# EAGLE board A10-OLinuXino_Rev_A (EAGLE 5.12), part 1 of 5
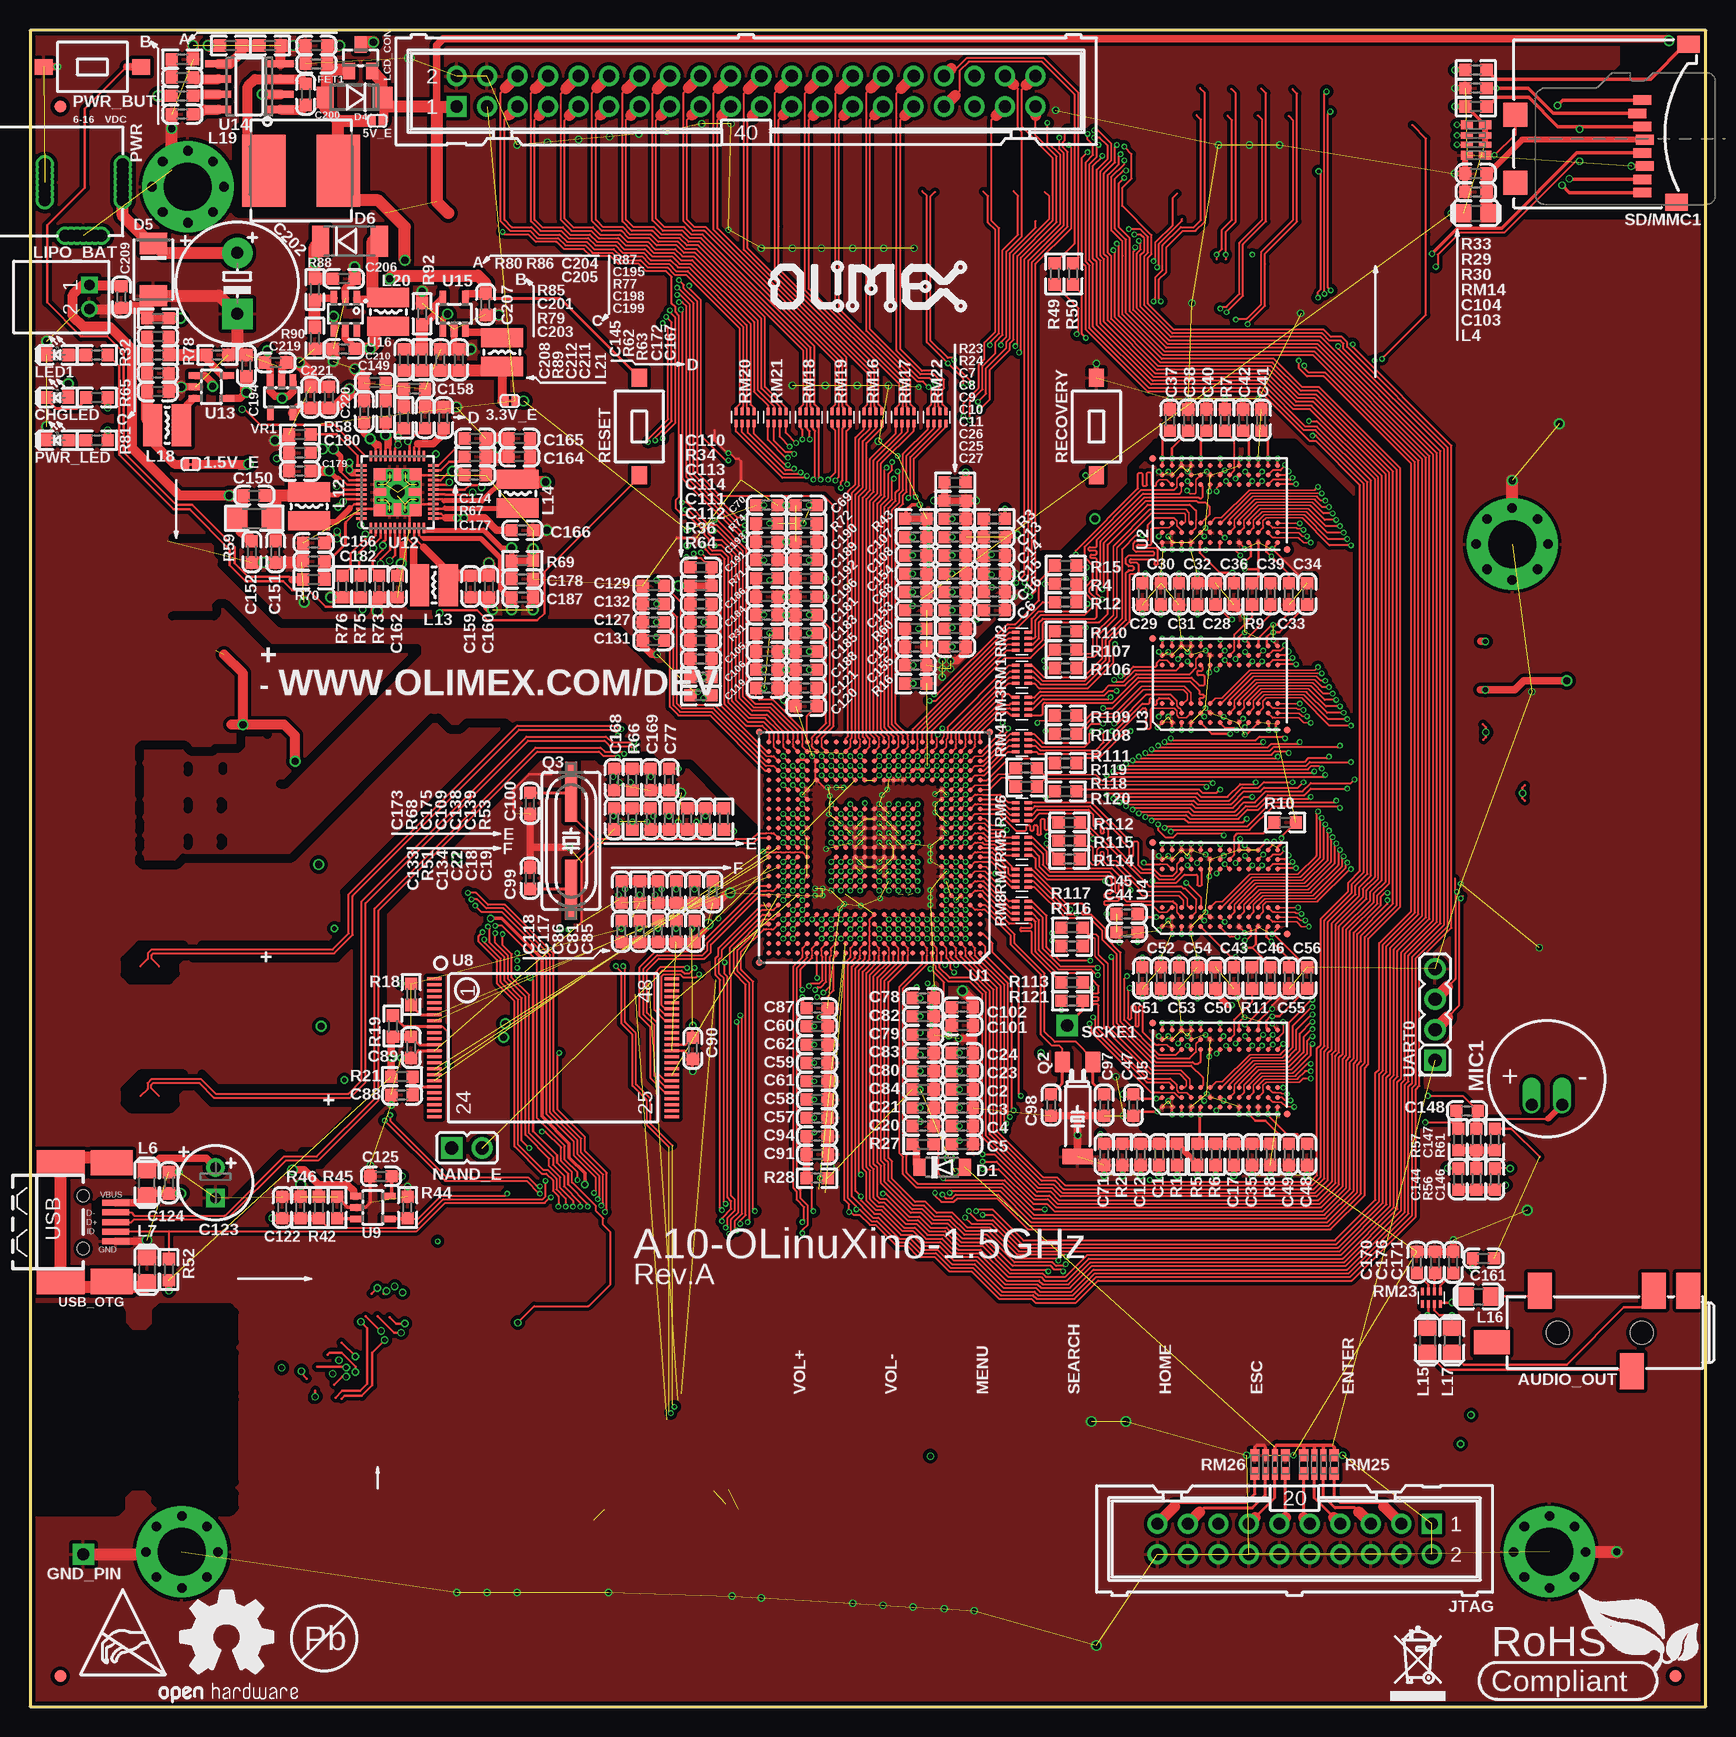
[diagram p5: board, top side]
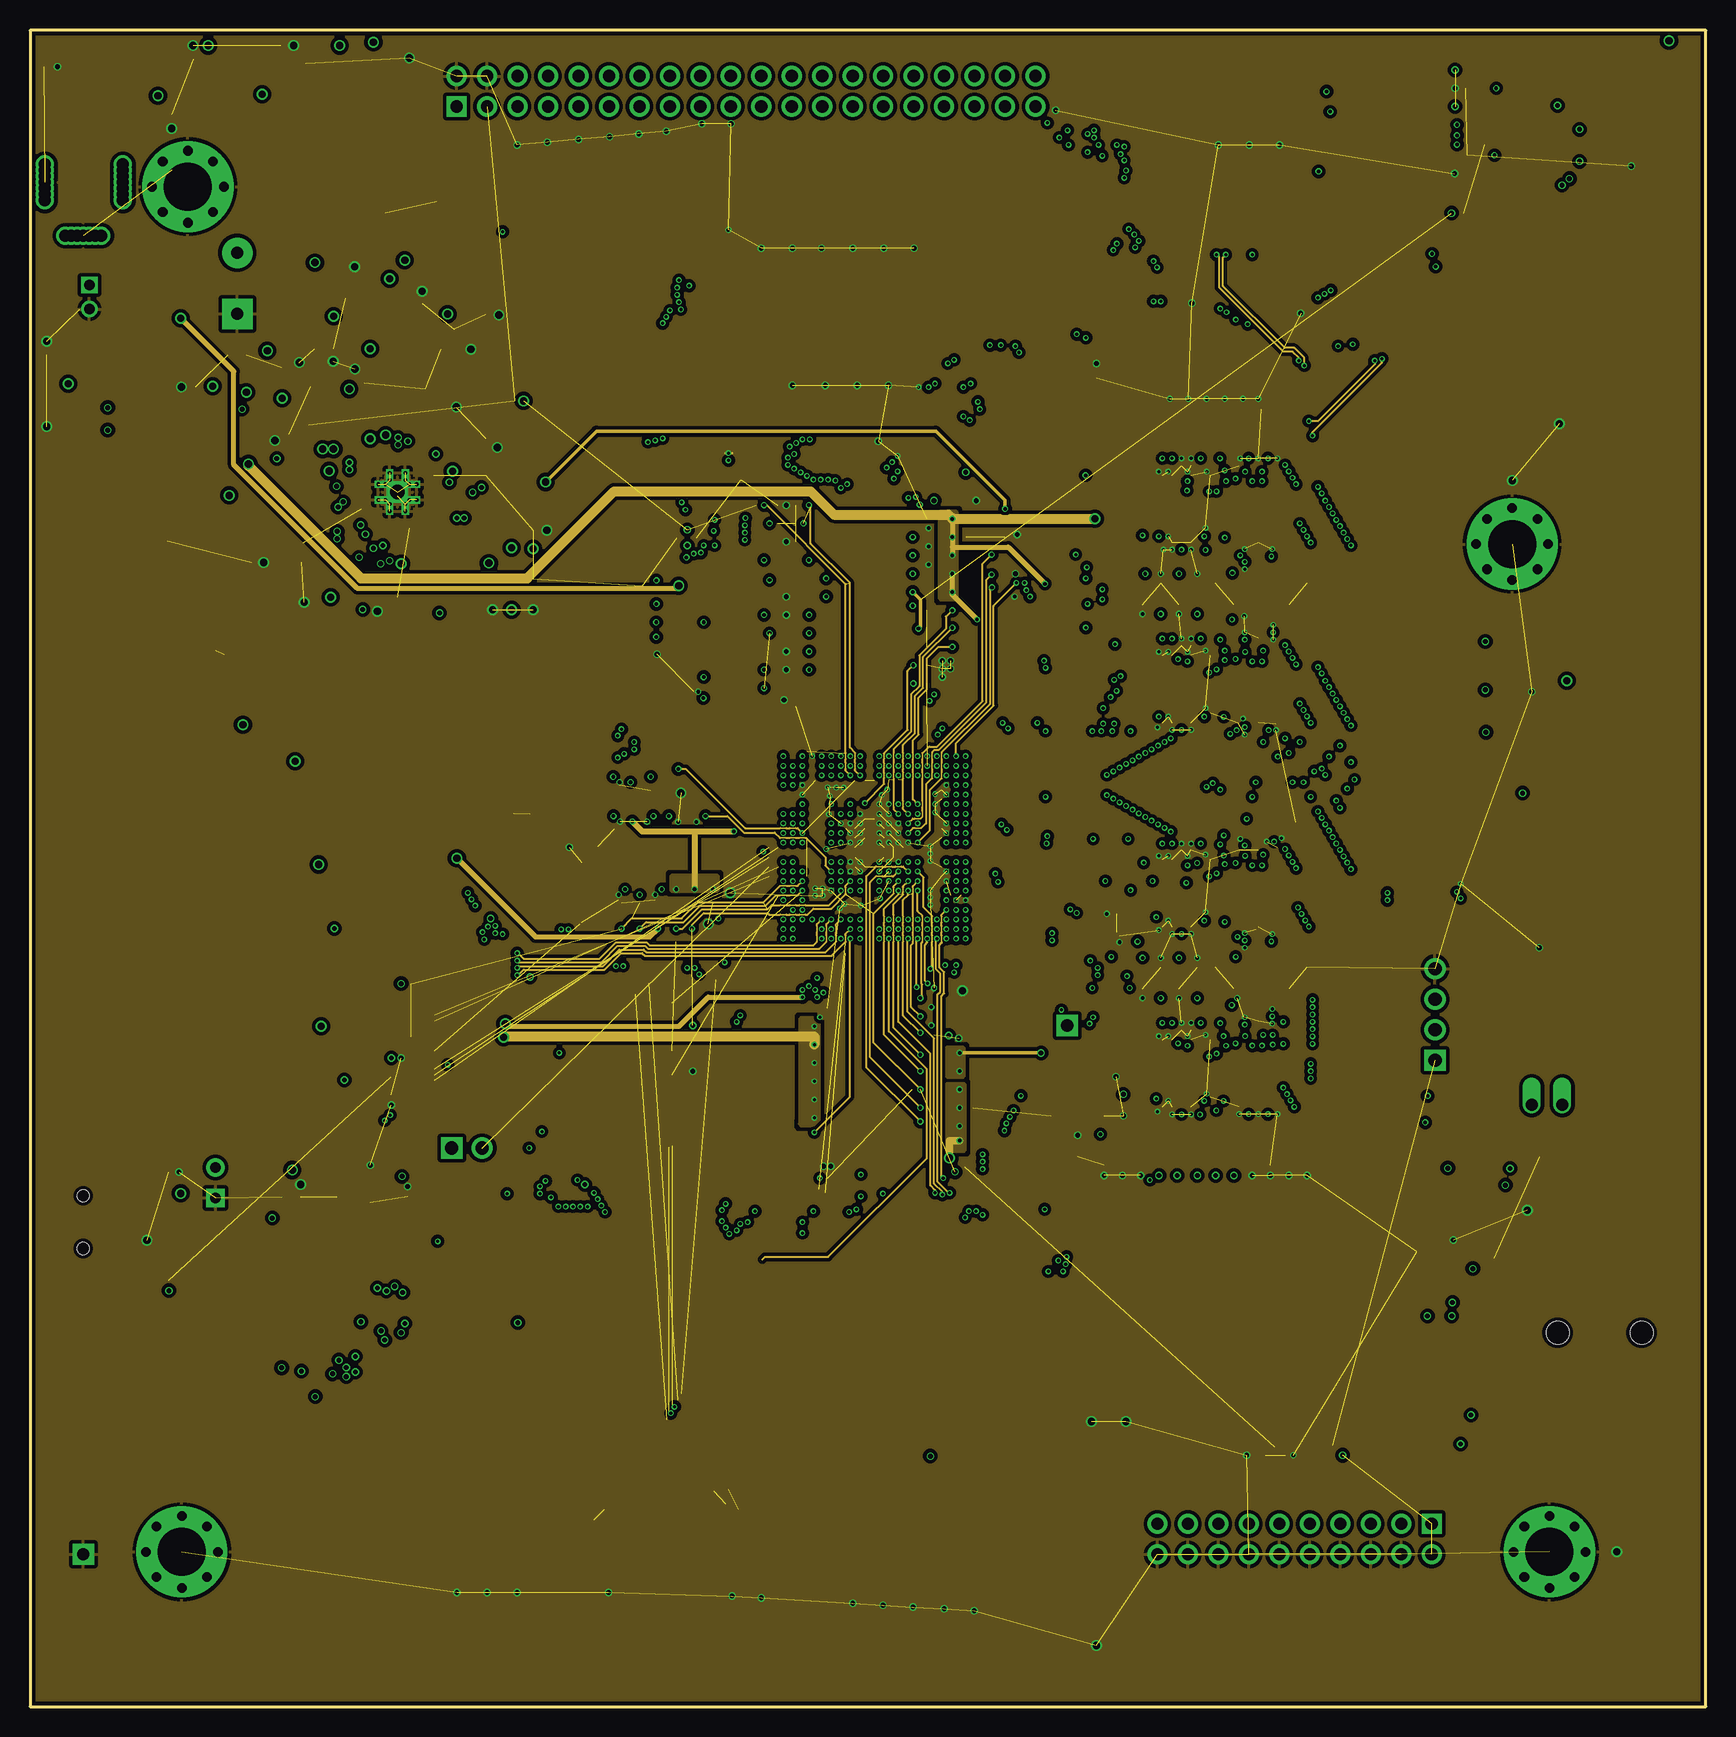
[diagram p6: board, inner layer Route2]
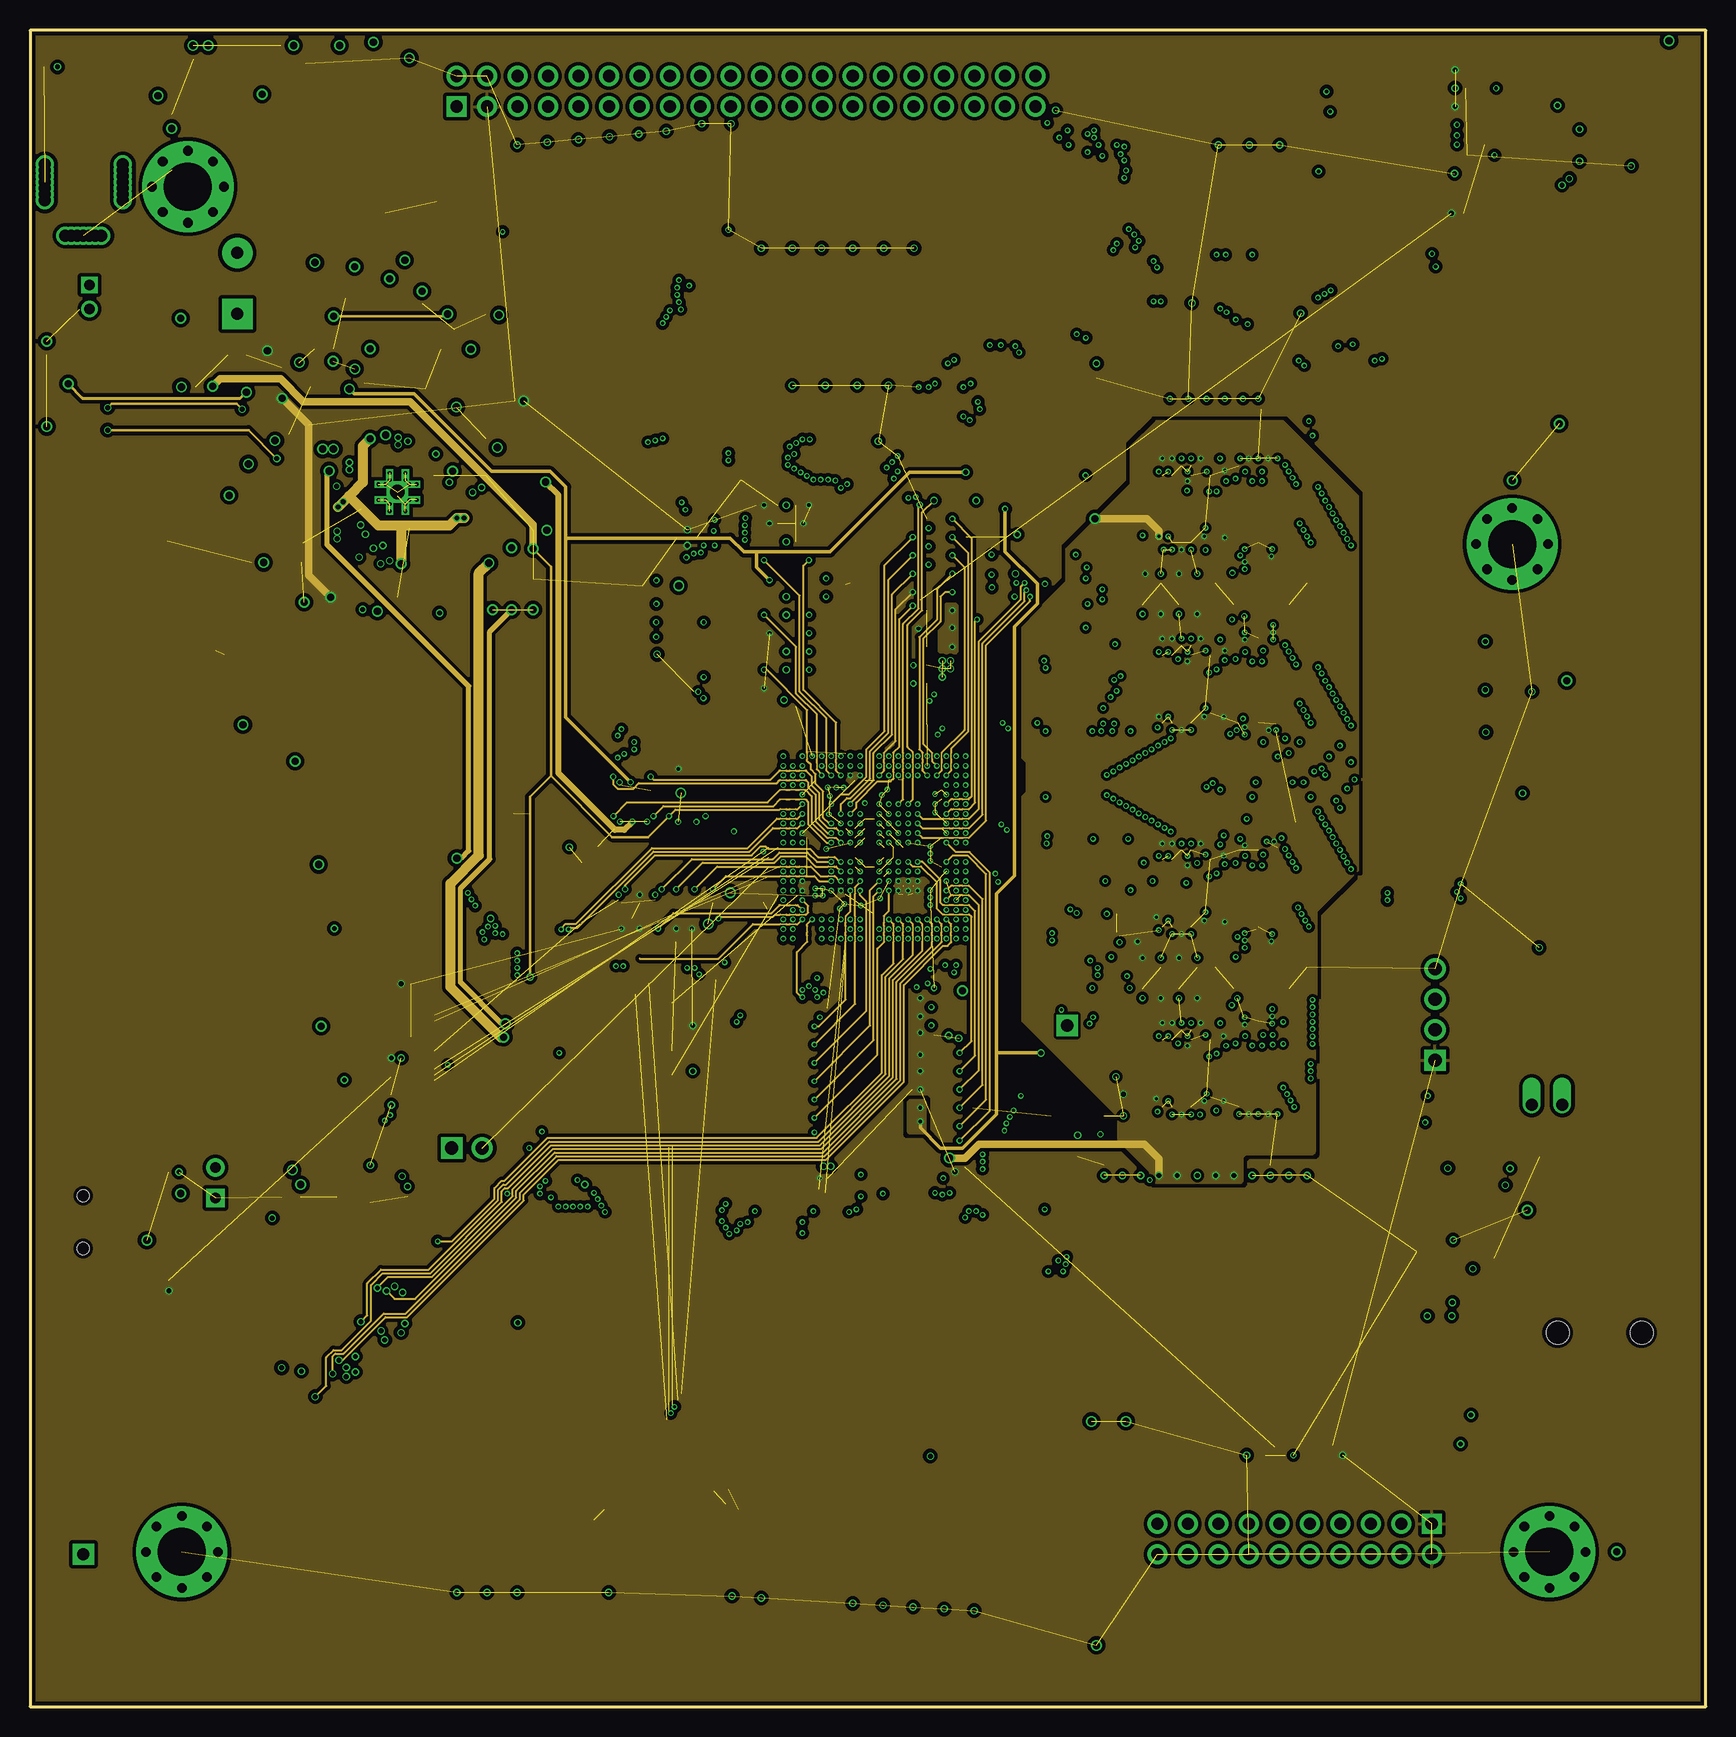
[diagram p7: board, inner layer Route15]
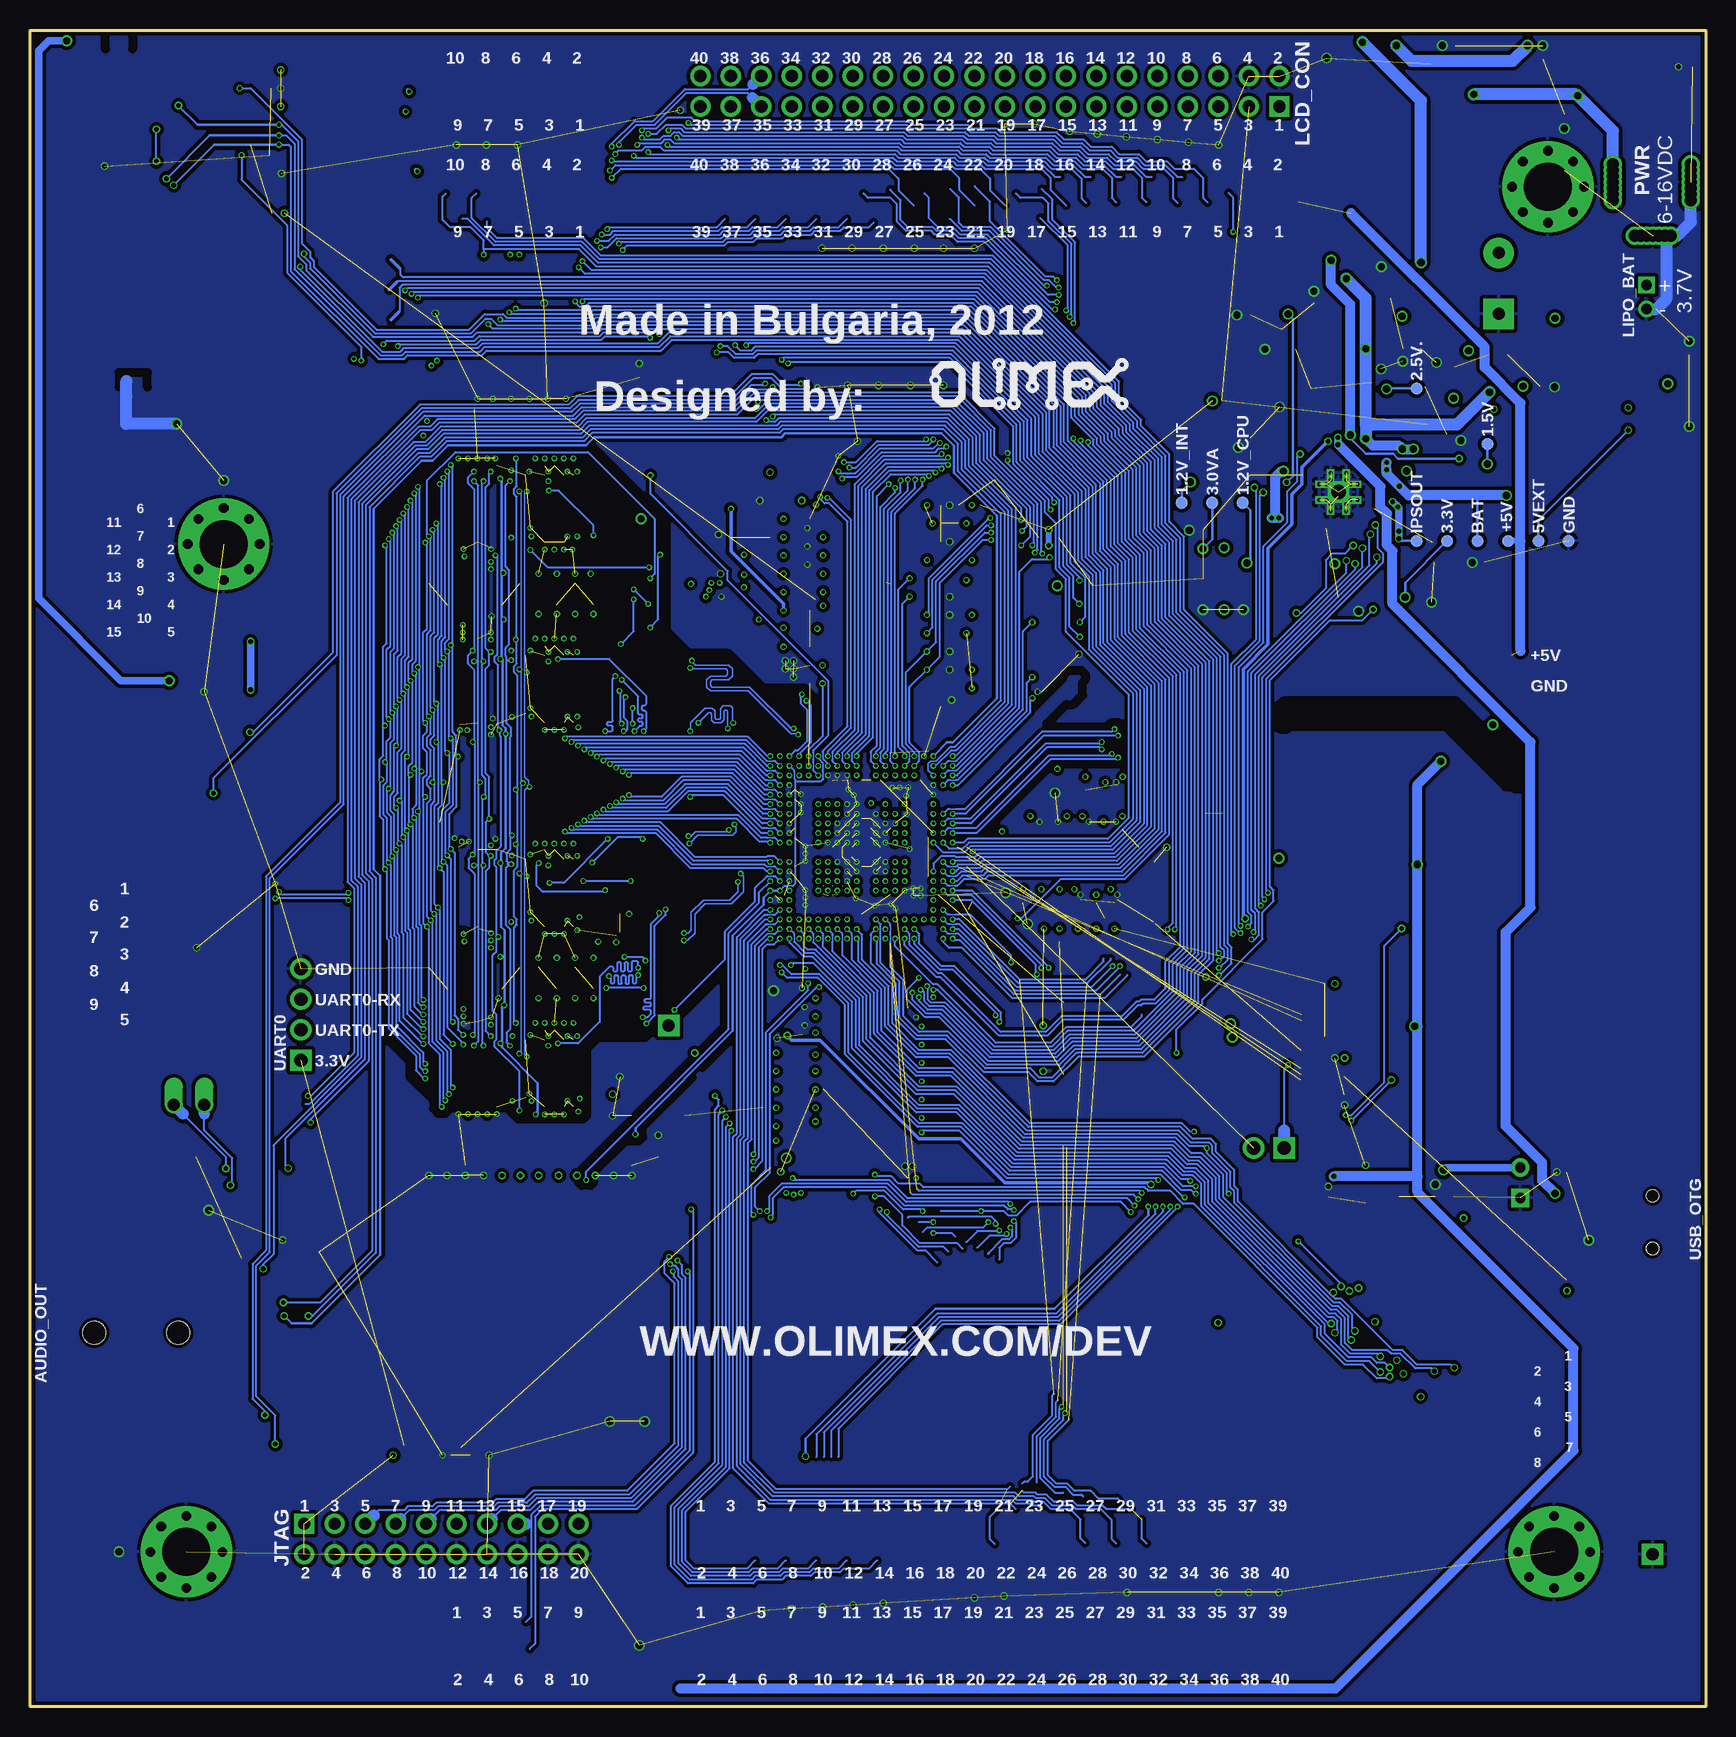
[diagram p8: board, bottom side, seen from below]

Size 139.7 x 139.7 mm. Coordinates in mm from the lower left corner, seen from the top.
Copper layers (1*2*15*16): Top 0.018mm / dielectric 0.12mm / Route2 0.035mm / dielectric 1.2mm / Route15 0.035mm / dielectric 0.12mm / Bottom 0.018mm
Design rules "default": minimum track width 4.5mil, minimum drill 10mil, track to track 5mil, track to pad 5mil, pad to pad 5mil, via to via 5mil, smd to smd 1mil, copper to edge 10mil, drill to drill 8mil, minimum pad ring 6mil, minimum via ring 4mil, stop-mask expansion 4mil, vias tented up to drill 25mil, thermal gap 12mil
Net classes: 1 PWR: width 0.127 mm, drill 0.254 mm, clearance 0.076 mm
tKeepout: 1 lines
tRestrict: 391 lines
bRestrict: 505 lines

## Footprints (pad centres in the part's own frame; a part is rotated, then mirrored left to right if it is on the bottom)
TESTPAD_40-ROUND = smd 1.016 x 1.016: 1 0,0
SJ_1_SMALLER_CLOSE = smd 0.508 x 0.762: 1 -0.381,0; 2 0.381,0
SJ_1_SMALLER = smd 0.508 x 0.762: 1 -0.381,0; 2 0.381,0
PJ-W47S-05D2-LF_5PIN_V2 = smd 2 x 3: 1 2.1,-0.5; 2 14.5,-0.5; 3 6.8,6.2; 5 5,-0.5 | smd 3 x 2: 4 18.5,3.8 | hole 1.9: 6,3; 13,3
C0603_DWS = smd 1.016 x 1.016: 1 -0.889,0; 2 0.889,0
E2,5-6,3 = drill 0.864 pad 1.524 round: + -1.27,0 | drill 0.864 pad 1.524 square: - 1.27,0
E5-10,5 = drill 1.016 pad 2.54 round: + -2.54,0 | drill 1.016 pad 2.54 square: - 2.54,0
LED-0603 = smd 1.016 x 1.016: A 0.889,0; C -0.889,0
SOD-123 = smd 1 x 1.4: A 1.9,0; C -1.9,0
MLL-41 = smd 1.45 x 1.8: A 2.445,0; K -2.445,0
DO214AA = smd 1.778 x 2.286: A 2.177,0; C -2.177,0
MELF-MLL41 = smd 1.45 x 2.6: 1 -2.445,0; 2 2.445,0
SOT23 = smd 1 x 1.4: 1 -0.95,-1.1; 2 0.95,-1.1; 3 0,1.1
TEST_PAD40/70/SQUARE = drill 1.016 pad 1.778 square: P$1 0,0
ML20-MALE = drill 1.016 pad 1.676 square: 1 -11.43,-1.27 | drill 1.016 pad 1.676 round: 2 -11.43,1.27; 3 -8.89,-1.27; 4 -8.89,1.27; 5 -6.35,-1.27; 6 -6.35,1.27; 7 -3.81,-1.27; 8 -3.81,1.27; 9 -1.27,-1.27; 10 -1.27,1.27; 11 1.27,-1.27; 12 1.27,1.27; 13 3.81,-1.27; 14 3.81,1.27; 15 6.35,-1.27; 16 6.35,1.27; 17 8.89,-1.27; 18 8.89,1.27; 19 11.43,-1.27; 20 11.43,1.27
L0805_5MIL_DWS = smd 1.27 x 1.524: 1 -1.016,0; 2 1.016,0
CD32 = smd 3.5 x 1.6: 1 0,1.2; 2 0,-1.2
8X8MM_3131 = smd 3.6 x 6: 1 -3.1,0; 2 3.1,0
ML40 = drill 1.016 pad 1.676 square: 1 -24.13,-1.27 | drill 1.016 pad 1.676 round: 2 -24.13,1.27; 3 -21.59,-1.27; 4 -21.59,1.27; 5 -19.05,-1.27; 6 -19.05,1.27; 7 -16.51,-1.27; 8 -16.51,1.27; 9 -13.97,-1.27; 10 -13.97,1.27; 11 -11.43,-1.27; 12 -11.43,1.27; 13 -8.89,-1.27; 14 -8.89,1.27; 15 -6.35,-1.27; 16 -6.35,1.27; 17 -3.81,-1.27; 18 -3.81,1.27; 19 -1.27,-1.27; 20 -1.27,1.27; 21 1.27,-1.27; 22 1.27,1.27; 23 3.81,-1.27; 24 3.81,1.27; 25 6.35,-1.27; 26 6.35,1.27; 27 8.89,-1.27; 28 8.89,1.27; 29 11.43,-1.27; 30 11.43,1.27; 31 13.97,-1.27; 32 13.97,1.27; 33 16.51,-1.27; 34 16.51,1.27; 35 19.05,-1.27; 36 19.05,1.27; 37 21.59,-1.27; 38 21.59,1.27; 39 24.13,-1.27; 40 24.13,1.27
DW02R = drill 0.9 square: 1 -1,0 | drill 0.9 round: 2 1,0
MIC = drill 1 offset: P+ -1.27,-2.159; P- 1.27,-2.159
JP1 = drill 1.1 pad 1.778 square: 1 0,-1.27 | drill 1.1 pad 1.778 round: 2 0,1.27
PWR_JACK_UNI_MILLING = drill 1 round: + 0,4.75; +1 0,5.25; +2 0,5.75; +3 0,6.25; +4 0,4.25; +5 0,3.75; +6 0,3.25; - -6.5,4.75; -1 -6.5,5.25; -2 -6.5,5.75; -3 -6.5,4.25; -4 -6.5,3.75; -5 -6.5,6.25; -6 -6.5,3.25; -- -3.3,0.3; --1 -3.8,0.3; --2 -4.3,0.3; --3 -4.8,0.3; --4 -2.8,0.3; --5 -2.3,0.3; --6 -1.8,0.3
SW-TAKT_6X3.5_SMD = smd 1.27 x 1.524: P$1 0,4.064; P$2 0,-4.064
TC26H_3_REPAIR_SMD = smd 1.27 x 1.778: 1 -1.27,0; 2 1.27,0 | smd 2.54 x 1.27: GND 0,7.874
HC49/SMD2_THIN = smd 5 x 1: 1 -4.064,0; 2 4.064,0
R0603_5MIL_DWS = smd 1.016 x 1.016: 1 -0.889,0; 2 0.889,0
0603_0R = smd 1.016 x 1.016: 1 -0.889,0; 2 0.889,0
R1206_5MIL_WS = smd 1.651 x 1.778: 1 -1.46,0; 2 1.46,0
R_MATRIX_4_0402_25X625 = smd 0.625 x 0.25: 1.1 -0.512,0.75; 1.2 0.512,0.75; 2.1 -0.512,0.25; 2.2 0.512,0.25; 3.1 -0.512,-0.25; 3.2 0.512,-0.25; 4.1 -0.512,-0.75; 4.2 0.512,-0.75
R_MATRIX_4 = smd 1.016 x 0.762: 1.1 -0.762,1.27; 1.2 0.762,1.27; 4.1 -0.762,-1.27; 4.2 0.762,-1.27 | smd 1.016 x 0.508: 2.1 -0.762,0.381; 2.2 0.762,0.381; 3.1 -0.762,-0.381; 3.2 0.762,-0.381
TFR-MEM-CON = smd 0.8 x 1.5: 1 -3.2,10.7; 2 -2.1,10.3; 3 -1,10.7; 4 0.1,10.9; 5 1.2,10.7; 6 2.3,10.9; 7 3.4,10.7; 8 4.5,10.7 | smd 2 x 2: 9 3.7,0.1; 10 -2,0.1 | smd 1.4 x 1.9: 11 5.3,13.55; 12 -7.85,14.55
TFBGA441 = smd 0.4 x 0.4: A1 -8.8,8.8; A2 -8,8.8; A3 -7.2,8.8; A4 -6.4,8.8; A5 -5.6,8.8; A6 -4.8,8.8; A7 -4,8.8; A8 -3.2,8.8; A9 -2.4,8.8; A10 -1.6,8.8; A11 -0.8,8.8; A12 0,8.8; A13 0.8,8.8; A14 1.6,8.8; A15 2.4,8.8; A16 3.2,8.8; A17 4,8.8; A18 4.8,8.8; A19 5.6,8.8; A20 6.4,8.8; A21 7.2,8.8; A22 8,8.8; A23 8.8,8.8; AA1 -8.8,-7.2; AA2 -8,-7.2; AA3 -7.2,-7.2; AA4 -6.4,-7.2; AA5 -5.6,-7.2; AA6 -4.8,-7.2; AA7 -4,-7.2; AA8 -3.2,-7.2; AA9 -2.4,-7.2; AA10 -1.6,-7.2; AA11 -0.8,-7.2; AA12 0,-7.2; AA13 0.8,-7.2; AA14 1.6,-7.2; AA15 2.4,-7.2; AA16 3.2,-7.2; AA17 4,-7.2; AA18 4.8,-7.2; AA19 5.6,-7.2; AA20 6.4,-7.2; AA21 7.2,-7.2; AA22 8,-7.2; AA23 8.8,-7.2; AB1 -8.8,-8; AB2 -8,-8; AB3 -7.2,-8; AB4 -6.4,-8; AB5 -5.6,-8; AB6 -4.8,-8; AB7 -4,-8; AB8 -3.2,-8; AB9 -2.4,-8; AB10 -1.6,-8; AB11 -0.8,-8; AB12 0,-8; AB13 0.8,-8; AB14 1.6,-8; AB15 2.4,-8; AB16 3.2,-8; AB17 4,-8; AB18 4.8,-8; AB19 5.6,-8; AB20 6.4,-8; AB21 7.2,-8; AB22 8,-8; AB23 8.8,-8; AC1 -8.8,-8.8; AC2 -8,-8.8; AC3 -7.2,-8.8; AC4 -6.4,-8.8; AC5 -5.6,-8.8; AC6 -4.8,-8.8; AC7 -4,-8.8; AC8 -3.2,-8.8; AC9 -2.4,-8.8; AC10 -1.6,-8.8; AC11 -0.8,-8.8; AC12 0,-8.8; AC13 0.8,-8.8; AC14 1.6,-8.8; AC15 2.4,-8.8; AC16 3.2,-8.8; AC17 4,-8.8; AC18 4.8,-8.8; AC19 5.6,-8.8; AC20 6.4,-8.8; AC21 7.2,-8.8; AC22 8,-8.8; AC23 8.8,-8.8; B1 -8.8,8; B2 -8,8; B3 -7.2,8; B4 -6.4,8; B5 -5.6,8; B6 -4.8,8; B7 -4,8; B8 -3.2,8; B9 -2.4,8; B10 -1.6,8; B11 -0.8,8; B12 0,8; B13 0.8,8; B14 1.6,8; B15 2.4,8; B16 3.2,8; B17 4,8; B18 4.8,8; B19 5.6,8; B20 6.4,8; B21 7.2,8; B22 8,8; B23 8.8,8; C1 -8.8,7.2; C2 -8,7.2; C3 -7.2,7.2; C4 -6.4,7.2; C5 -5.6,7.2; C6 -4.8,7.2; C7 -4,7.2; C8 -3.2,7.2; C9 -2.4,7.2; C10 -1.6,7.2; C11 -0.8,7.2; C12 0,7.2; C13 0.8,7.2; C14 1.6,7.2; C15 2.4,7.2; C16 3.2,7.2; C17 4,7.2; C18 4.8,7.2; C19 5.6,7.2; C20 6.4,7.2; C21 7.2,7.2; C22 8,7.2; C23 8.8,7.2; D1 -8.8,6.4; D2 -8,6.4; D3 -7.2,6.4; D4 -6.4,6.4; D5 -5.6,6.4; D6 -4.8,6.4; D7 -4,6.4; D8 -3.2,6.4; D9 -2.4,6.4; D10 -1.6,6.4; D11 -0.8,6.4; D12 0,6.4; D13 0.8,6.4; D14 1.6,6.4; D15 2.4,6.4; D16 3.2,6.4; D17 4,6.4; D18 4.8,6.4; D19 5.6,6.4; D20 6.4,6.4; D21 7.2,6.4; D22 8,6.4; D23 8.8,6.4; E1 -8.8,5.6; E2 -8,5.6; E3 -7.2,5.6; E4 -6.4,5.6; E5 -5.6,5.6; E6 -4.8,5.6; E7 -4,5.6; E8 -3.2,5.6; E9 -2.4,5.6; E10 -1.6,5.6; E11 -0.8,5.6; E12 0,5.6; E13 0.8,5.6; E14 1.6,5.6; E15 2.4,5.6; E16 3.2,5.6; E17 4,5.6; E18 4.8,5.6; E19 5.6,5.6; E20 6.4,5.6; E21 7.2,5.6; E22 8,5.6; E23 8.8,5.6; F1 -8.8,4.8; F2 -8,4.8; F3 -7.2,4.8; F4 -6.4,4.8; F5 -5.6,4.8; F19 5.6,4.8; F20 6.4,4.8; F21 7.2,4.8; F22 8,4.8; F23 8.8,4.8; G1 -8.8,4; G2 -8,4; G3 -7.2,4; G4 -6.4,4; G5 -5.6,4; G19 5.6,4; G20 6.4,4; G21 7.2,4; G22 8,4; G23 8.8,4; H1 -8.8,3.2; H2 -8,3.2; H3 -7.2,3.2; H4 -6.4,3.2; H5 -5.6,3.2; H8 -3.2,3.2; H9 -2.4,3.2; H10 -1.6,3.2; H11 -0.8,3.2; H12 0,3.2; H13 0.8,3.2; H14 1.6,3.2; H15 2.4,3.2; H16 3.2,3.2; H19 5.6,3.2; H20 6.4,3.2; H21 7.2,3.2; H22 8,3.2; H23 8.8,3.2; J1 -8.8,2.4; J2 -8,2.4; J3 -7.2,2.4; J4 -6.4,2.4; J5 -5.6,2.4; J8 -3.2,2.4; J9 -2.4,2.4; J10 -1.6,2.4; J11 -0.8,2.4; J12 0,2.4; J13 0.8,2.4; J14 1.6,2.4; J15 2.4,2.4; J16 3.2,2.4; J19 5.6,2.4; J20 6.4,2.4; J21 7.2,2.4; J22 8,2.4; J23 8.8,2.4; K1 -8.8,1.6; K2 -8,1.6; K3 -7.2,1.6; K4 -6.4,1.6; K5 -5.6,1.6; K8 -3.2,1.6; K9 -2.4,1.6; K10 -1.6,1.6; K11 -0.8,1.6; K12 0,1.6; K13 0.8,1.6; K14 1.6,1.6; K15 2.4,1.6; K16 3.2,1.6; K19 5.6,1.6; K20 6.4,1.6; K21 7.2,1.6; K22 8,1.6; K23 8.8,1.6; L1 -8.8,0.8; L2 -8,0.8; L3 -7.2,0.8; L4 -6.4,0.8; L5 -5.6,0.8; L8 -3.2,0.8; L9 -2.4,0.8; L10 -1.6,0.8; L11 -0.8,0.8; L12 0,0.8; L13 0.8,0.8; L14 1.6,0.8; L15 2.4,0.8; L16 3.2,0.8; L19 5.6,0.8; L20 6.4,0.8; L21 7.2,0.8; L22 8,0.8; L23 8.8,0.8; M1 -8.8,0; M2 -8,0; M3 -7.2,0; M4 -6.4,0; M5 -5.6,0; M8 -3.2,0; M9 -2.4,0; M10 -1.6,0; M11 -0.8,0; M12 0,0; M13 0.8,0; M14 1.6,0; M15 2.4,0; M16 3.2,0; M19 5.6,0; M20 6.4,0; M21 7.2,0; M22 8,0; M23 8.8,0; N1 -8.8,-0.8; N2 -8,-0.8; N3 -7.2,-0.8; N4 -6.4,-0.8; N5 -5.6,-0.8; N8 -3.2,-0.8; N9 -2.4,-0.8; N10 -1.6,-0.8; N11 -0.8,-0.8; N12 0,-0.8; N13 0.8,-0.8; N14 1.6,-0.8; N15 2.4,-0.8; N16 3.2,-0.8; N19 5.6,-0.8; N20 6.4,-0.8; N21 7.2,-0.8; N22 8,-0.8; N23 8.8,-0.8; P1 -8.8,-1.6; P2 -8,-1.6; P3 -7.2,-1.6; P4 -6.4,-1.6; P5 -5.6,-1.6; P8 -3.2,-1.6; P9 -2.4,-1.6; P10 -1.6,-1.6; P11 -0.8,-1.6; P12 0,-1.6; P13 0.8,-1.6; P14 1.6,-1.6; P15 2.4,-1.6; P16 3.2,-1.6; P19 5.6,-1.6; P20 6.4,-1.6; P21 7.2,-1.6; P22 8,-1.6; P23 8.8,-1.6; R1 -8.8,-2.4; R2 -8,-2.4; R3 -7.2,-2.4; R4 -6.4,-2.4; R5 -5.6,-2.4; R8 -3.2,-2.4; R9 -2.4,-2.4; R10 -1.6,-2.4; R11 -0.8,-2.4; R12 0,-2.4; R13 0.8,-2.4; R14 1.6,-2.4; R15 2.4,-2.4; R16 3.2,-2.4; R19 5.6,-2.4; R20 6.4,-2.4; R21 7.2,-2.4; R22 8,-2.4; R23 8.8,-2.4; T1 -8.8,-3.2; T2 -8,-3.2; T3 -7.2,-3.2; T4 -6.4,-3.2; T5 -5.6,-3.2; T8 -3.2,-3.2; T9 -2.4,-3.2; T10 -1.6,-3.2; T11 -0.8,-3.2; T12 0,-3.2; T13 0.8,-3.2; T14 1.6,-3.2; T15 2.4,-3.2; T16 3.2,-3.2; T19 5.6,-3.2; T20 6.4,-3.2; T21 7.2,-3.2; T22 8,-3.2; T23 8.8,-3.2; U1 -8.8,-4; U2 -8,-4; U3 -7.2,-4; U4 -6.4,-4; U5 -5.6,-4; U19 5.6,-4; U20 6.4,-4; U21 7.2,-4; U22 8,-4; U23 8.8,-4; V1 -8.8,-4.8; V2 -8,-4.8; V3 -7.2,-4.8; V4 -6.4,-4.8; V5 -5.6,-4.8; V19 5.6,-4.8; V20 6.4,-4.8; V21 7.2,-4.8; V22 8,-4.8; V23 8.8,-4.8; W1 -8.8,-5.6; W2 -8,-5.6; W3 -7.2,-5.6; W4 -6.4,-5.6; W5 -5.6,-5.6; W6 -4.8,-5.6; W7 -4,-5.6; W8 -3.2,-5.6; W9 -2.4,-5.6; W10 -1.6,-5.6; W11 -0.8,-5.6; W12 0,-5.6; W13 0.8,-5.6; W14 1.6,-5.6; W15 2.4,-5.6; W16 3.2,-5.6; W17 4,-5.6; W18 4.8,-5.6; W19 5.6,-5.6; W20 6.4,-5.6; W21 7.2,-5.6; W22 8,-5.6; W23 8.8,-5.6; Y1 -8.8,-6.4; Y2 -8,-6.4; Y3 -7.2,-6.4; Y4 -6.4,-6.4; Y5 -5.6,-6.4; Y6 -4.8,-6.4; Y7 -4,-6.4; Y8 -3.2,-6.4; Y9 -2.4,-6.4; Y10 -1.6,-6.4; Y11 -0.8,-6.4; Y12 0,-6.4; Y13 0.8,-6.4; Y14 1.6,-6.4; Y15 2.4,-6.4; Y16 3.2,-6.4; Y17 4,-6.4; Y18 4.8,-6.4; Y19 5.6,-6.4; Y20 6.4,-6.4; Y21 7.2,-6.4; Y22 8,-6.4; Y23 8.8,-6.4 | smd 0.6 x 0.6: FID1 9.6,9.6; FID2 9.6,-9.6; FID3 -9.6,-9.6
FBGA78 = smd 0.4 x 0.4: A1 -3.2,4.8; A2 -2.4,4.8; A3 -1.6,4.8; A7 1.6,4.8; A8 2.4,4.8; A9 3.2,4.8; B1 -3.2,4; B2 -2.4,4; B3 -1.6,4; B7 1.6,4; B8 2.4,4; B9 3.2,4; C1 -3.2,3.2; C2 -2.4,3.2; C3 -1.6,3.2; C7 1.6,3.2; C8 2.4,3.2; C9 3.2,3.2; D1 -3.2,2.4; D2 -2.4,2.4; D3 -1.6,2.4; D7 1.6,2.4; D8 2.4,2.4; D9 3.2,2.4; E1 -3.2,1.6; E2 -2.4,1.6; E3 -1.6,1.6; E7 1.6,1.6; E8 2.4,1.6; E9 3.2,1.6; F1 -3.2,0.8; F2 -2.4,0.8; F3 -1.6,0.8; F7 1.6,0.8; F8 2.4,0.8; F9 3.2,0.8; G1 -3.2,0; G2 -2.4,0; G3 -1.6,0; G7 1.6,0; G8 2.4,0; G9 3.2,0; H1 -3.2,-0.8; H2 -2.4,-0.8; H3 -1.6,-0.8; H7 1.6,-0.8; H8 2.4,-0.8; H9 3.2,-0.8; J1 -3.2,-1.6; J2 -2.4,-1.6; J3 -1.6,-1.6; J7 1.6,-1.6; J8 2.4,-1.6; J9 3.2,-1.6; K1 -3.2,-2.4; K2 -2.4,-2.4; K3 -1.6,-2.4; K7 1.6,-2.4; K8 2.4,-2.4; K9 3.2,-2.4; L1 -3.2,-3.2; L2 -2.4,-3.2; L3 -1.6,-3.2; L7 1.6,-3.2; L8 2.4,-3.2; L9 3.2,-3.2; M1 -3.2,-4; M2 -2.4,-4; M3 -1.6,-4; M7 1.6,-4; M8 2.4,-4; M9 3.2,-4; N1 -3.2,-4.8; N2 -2.4,-4.8; N3 -1.6,-4.8; N7 1.6,-4.8; N8 2.4,-4.8; N9 3.2,-4.8 | smd 0.6 x 0.6: FID1 -3.8,-5.6; FID2 3.8,5.6
TSOP48 = smd 0.25 x 1.2: 1 -5.75,-9.9; 2 -5.25,-9.9; 3 -4.75,-9.9; 4 -4.25,-9.9; 5 -3.75,-9.9; 6 -3.25,-9.9; 7 -2.75,-9.9; 8 -2.25,-9.9; 9 -1.75,-9.9; 10 -1.25,-9.9; 11 -0.75,-9.9; 12 -0.25,-9.9; 13 0.25,-9.9; 14 0.75,-9.9; 15 1.25,-9.9; 16 1.75,-9.9; 17 2.25,-9.9; 18 2.75,-9.9; 19 3.25,-9.9; 20 3.75,-9.9; 21 4.25,-9.9; 22 4.75,-9.9; 23 5.25,-9.9; 24 5.75,-9.9; 25 5.75,9.9; 26 5.25,9.9; 27 4.75,9.9; 28 4.25,9.9; 29 3.75,9.9; 30 3.25,9.9; 31 2.75,9.9; 32 2.25,9.9; 33 1.75,9.9; 34 1.25,9.9; 35 0.75,9.9; 36 0.25,9.9; 37 -0.25,9.9; 38 -0.75,9.9; 39 -1.25,9.9; 40 -1.75,9.9; 41 -2.25,9.9; 42 -2.75,9.9; 43 -3.25,9.9; 44 -3.75,9.9; 45 -4.25,9.9; 46 -4.75,9.9; 47 -5.25,9.9; 48 -5.75,9.9
SOT23-5 = smd 0.55 x 1.2: 1 -0.95,-1.3; 2 0,-1.3; 3 0.95,-1.3; 4 0.95,1.3; 5 -0.95,1.3
QFN48 = smd 0.2 x 0.9: 1 -2.2,-3; 2 -1.8,-3; 3 -1.4,-3; 4 -1,-3; 5 -0.6,-3; 6 -0.2,-3; 7 0.2,-3; 8 0.6,-3; 9 1,-3; 10 1.4,-3; 11 1.8,-3; 12 2.2,-3; 25 2.2,3; 26 1.8,3; 27 1.4,3; 28 1,3; 29 0.6,3; 30 0.2,3; 31 -0.2,3; 32 -0.6,3; 33 -1,3; 34 -1.4,3; 35 -1.8,3; 36 -2.2,3 | smd 0.9 x 0.2: 13 3,-2.2; 14 3,-1.8; 15 3,-1.4; 16 3,-1; 17 3,-0.6; 18 3,-0.2; 19 3,0.2; 20 3,0.6; 21 3,1; 22 3,1.4; 23 3,1.8; 24 3,2.2; 37 -3,2.2; 38 -3,1.8; 39 -3,1.4; 40 -3,1; 41 -3,0.6; 42 -3,0.2; 43 -3,-0.2; 44 -3,-0.6; 45 -3,-1; 46 -3,-1.4; 47 -3,-1.8; 48 -3,-2.2 | drill 1.2 pad 1.422 square: N1 0,0 | drill 0.3 pad 0.4 square: N2 -1.6,0.65; N3 -1,0.65; N4 -1.6,-0.65; N5 -1,-0.65; N6 -0.65,-1.6; N7 -0.65,-1; N8 0.65,-1.6; N9 0.65,-1; N10 1.6,-0.65; N11 1,-0.65; N12 1.6,0.65; N13 1,0.65; N14 0.65,1.6; N15 0.65,1; N16 -0.65,1.6; N17 -0.65,1 | smd 4 x 4: VSS 0,0
SOIC8 = smd 0.6 x 2.2: 1 -1.905,-2.6; 2 -0.635,-2.6; 3 0.635,-2.6; 4 1.905,-2.6; 5 1.905,2.6; 6 0.635,2.6; 7 -0.635,2.6; 8 -1.905,2.6
SOT23-6 = smd 0.55 x 1.2: 1 -0.95,-1.3; 2 0,-1.3; 3 0.95,-1.3; 4 0.95,1.3; 5 0,1.3; 6 -0.95,1.3
FIDUCIAL-1X2 = smd 1 x 1: 1 0,0
NANO-ITX_140X140 = drill 4 pad 7.6 round: GND 12.656,12.906; P$2 13.166,126.666; P$3 126.666,12.906; P$4 123.556,96.886 | drill 0.8 round: P$11 9.656,12.906; P$12 15.656,12.906; P$13 12.656,15.906; P$14 12.656,9.906; P$15 10.556,10.806; P$16 14.756,10.806; P$17 14.756,15.006; P$18 10.556,15.006; P$20 10.166,126.666; P$21 16.166,126.666; P$22 13.166,129.666; P$23 13.166,123.666; P$24 11.066,124.566; P$25 15.266,124.566; P$26 15.266,128.766; P$27 11.066,128.766; P$29 123.666,12.906; P$30 129.666,12.906; P$31 126.666,15.906; P$32 126.666,9.906; P$33 124.566,10.806; P$34 128.766,10.806; P$35 128.766,15.006; P$36 124.566,15.006; P$38 120.556,96.886; P$39 126.556,96.886; P$40 123.556,99.886; P$41 123.556,93.886; P$42 121.456,94.786; P$43 125.656,94.786; P$44 125.656,98.986; P$45 121.456,98.986
HN1X4 = drill 1.1 pad 1.778 square: 1 -3.81,0 | drill 1.1 pad 1.778 round: 2 -1.27,0; 3 1.27,0; 4 3.81,0
USB_MINI_9PIN = smd 2.25 x 0.5: D+ 2.706,0; D- 2.706,0.8; GND 2.706,-1.6; ID 2.706,-0.8; VBUS 2.706,1.6 | smd 4 x 2.1: GND1 -1.9,4.95; GND3 -1.9,-4.95 | smd 3.5 x 2.1: GND2 2.35,4.95; GND4 2.35,-4.95 | hole 1: 0,2.2; 0,-2.2
SOT-23-5 = smd 0.55 x 1.2: 1 -0.95,-1.3; 2 0,-1.3; 3 0.95,-1.3; 4 0.95,1.3; 5 -0.95,1.3

## Placement (x,y rotation side)
1.2V_CPU  TESTPADTESTPAD_40-ROUND  [TESTPAD_40-ROUND]  38.61,100.33 0 bottom
1.2V_INT  TESTPADTESTPAD_40-ROUND  [TESTPAD_40-ROUND]  43.69,100.33 0 bottom
1.5V  TESTPADTESTPAD_40-ROUND  [TESTPAD_40-ROUND]  18.21,105.21 0 bottom
1.5V_E  Close  [SJ_1_SMALLER_CLOSE]  13.41,103.56 0 top
2.5V.  TESTPADTESTPAD_40-ROUND  [TESTPAD_40-ROUND]  24.13,109.86 0 bottom
3.0VA  TESTPADTESTPAD_40-ROUND  [TESTPAD_40-ROUND]  41.15,100.33 0 bottom
3.3V  TESTPADTESTPAD_40-ROUND  [TESTPAD_40-ROUND]  21.59,97.16 0 bottom
3.3V_E  Close  [SJ_1_SMALLER_CLOSE]  40.01,108.81 0 top
5V_E  Open  [SJ_1_SMALLER]  28.96,132.16 0 top
5VEXT  TESTPADTESTPAD_40-ROUND  [TESTPAD_40-ROUND]  13.97,97.16 0 bottom
+5V  TESTPADTESTPAD_40-ROUND  [TESTPAD_40-ROUND]  16.51,97.16 0 bottom
AUDIO_OUT  PJ-W47S-05D2-LF_V2  [PJ-W47S-05D2-LF_5PIN_V2]  140.34,34.16 180 top
BAT  TESTPADTESTPAD_40-ROUND  [TESTPAD_40-ROUND]  19.05,97.16 0 bottom
C1  220nF  [C0603_DWS]  94.11,46.02 90 top
C2  220nF  [C0603_DWS]  77.72,51.44 180 top
C3  220nF  [C0603_DWS]  77.72,49.91 180 top
C4  220nF  [C0603_DWS]  77.72,48.39 180 top
C5  220nF  [C0603_DWS]  77.72,46.86 180 top
C6  220nF  [C0603_DWS]  80.39,91.36 180 top
C7  220nF  [C0603_DWS]  77.11,98.98 180 top
C8  220nF  [C0603_DWS]  77.11,97.46 180 top
C9  220nF  [C0603_DWS]  77.11,95.94 180 top
C10  220nF  [C0603_DWS]  77.11,94.41 180 top
C11  220nF  [C0603_DWS]  77.11,92.89 180 top
C12  220nF  [C0603_DWS]  92.58,46.02 90 top
C13  22uF/6.3V  [C0603_DWS]  80.39,97.46 180 top
C14  220nF  [C0603_DWS]  80.39,95.94 180 top
C15  220nF  [C0603_DWS]  80.39,94.41 180 top
C16  220nF  [C0603_DWS]  80.39,92.89 180 top
C17  220nF  [C0603_DWS]  100.36,46.02 90 top
C18  220nF  [C0603_DWS]  55.4,67.89 90 top
C19  220nF  [C0603_DWS]  56.92,67.89 90 top
C20  220nF  [C0603_DWS]  74.45,48.39 180 top
C21  220nF  [C0603_DWS]  74.45,49.91 180 top
C22  220nF  [C0603_DWS]  53.87,67.89 90 top
C23  220nF  [C0603_DWS]  77.72,52.96 180 top
C24  220nF  [C0603_DWS]  77.72,54.48 180 top
C25  220nF  [C0603_DWS]  77.11,89.84 180 top
C26  220nF  [C0603_DWS]  77.11,91.36 180 top
C27  220nF  [C0603_DWS]  77.11,88.32 180 top
C28  220nF  [C0603_DWS]  98.83,92.74 270 top
C29  220nF  [C0603_DWS]  92.74,92.74 90 top
C30  220nF  [C0603_DWS]  94.26,92.74 270 top
C31  220nF  [C0603_DWS]  95.78,92.74 90 top
C32  220nF  [C0603_DWS]  97.31,92.74 270 top
C33  220nF  [C0603_DWS]  104.93,92.74 90 top
C34  220nF  [C0603_DWS]  106.45,92.74 270 top
C35  220nF  [C0603_DWS]  101.88,46.02 90 top
C36  220nF  [C0603_DWS]  100.36,92.74 90 top
C37  220nF  [C0603_DWS]  95.02,107.21 270 top
C38  220nF  [C0603_DWS]  96.55,107.21 270 top
C39  220nF  [C0603_DWS]  103.4,92.74 270 top
C40  220nF  [C0603_DWS]  98.07,107.21 270 top
C41  220nF  [C0603_DWS]  102.64,107.21 270 top
C42  220nF  [C0603_DWS]  101.12,107.21 270 top
C43  220nF  [C0603_DWS]  100.36,60.73 90 top
C44  220nF  [C0603_DWS]  91.44,64.54 0 top
C45  220nF  [C0603_DWS]  91.44,66.07 0 top
C46  220nF  [C0603_DWS]  103.4,60.73 270 top
C47  220nF  [C0603_DWS]  91.97,50.14 90 top
C48  220nF  [C0603_DWS]  106.45,46.02 90 top
C49  220nF  [C0603_DWS]  104.93,46.02 90 top
C50  220nF  [C0603_DWS]  98.83,60.73 270 top
C51  220nF  [C0603_DWS]  92.74,60.73 90 top
C52  220nF  [C0603_DWS]  94.26,60.73 270 top
C53  220nF  [C0603_DWS]  95.78,60.73 90 top
C54  220nF  [C0603_DWS]  97.31,60.73 270 top
C55  220nF  [C0603_DWS]  104.93,60.73 90 top
C56  220nF  [C0603_DWS]  106.45,60.73 270 top
C57  220nF  [C0603_DWS]  65.61,49.07 180 top
C58  220nF  [C0603_DWS]  65.61,50.6 180 top
C59  220nF  [C0603_DWS]  65.61,53.64 180 top
C60  220nF  [C0603_DWS]  65.61,56.69 180 top
C61  220nF  [C0603_DWS]  65.61,52.12 180 top
C62  220nF  [C0603_DWS]  65.61,55.17 180 top
C68  220nF  [C0603_DWS]  73.84,92.89 180 top
C69  220nF  [C0603_DWS]  64.69,100.13 0 top
C70  220nF  [C0603_DWS]  61.42,100.13 180 top
C71  NA  [C0603_DWS]  89.53,46.02 90 top
C77  220nF  [C0603_DWS]  53.26,77.27 90 top
C78  220nF  [C0603_DWS]  74.45,59.05 180 top
C79  220nF  [C0603_DWS]  74.45,56.01 180 top
C80  220nF  [C0603_DWS]  74.45,52.96 180 top
C81  220nF  [C0603_DWS]  53.87,64.62 90 top
C82  220nF  [C0603_DWS]  74.45,57.53 180 top
C83  220nF  [C0603_DWS]  74.45,54.48 180 top
C84  220nF  [C0603_DWS]  74.45,51.44 180 top
C85  220nF  [C0603_DWS]  55.4,64.62 90 top
C86  220nF  [C0603_DWS]  52.35,64.62 90 top
C87  220nF  [C0603_DWS]  65.61,58.22 180 top
C88  100nF  [C0603_DWS]  31.01,50.98 0 top
C89  100nF  [C0603_DWS]  31.78,54.94 90 top
C90  100nF  [C0603_DWS]  55.24,54.86 90 top
C91  1uF  [C0603_DWS]  65.61,46.02 180 top
C94  100nF  [C0603_DWS]  65.61,47.55 180 top
C97  10pF  [C0603_DWS]  89.53,50.14 90 top
C98  10pF  [C0603_DWS]  85.12,50.14 90 top
C99  33pF  [C0603_DWS]  41.68,69.04 270 top
C100  33pF  [C0603_DWS]  41.68,75.29 90 top
C101  22uF/6.3V  [C0603_DWS]  77.72,56.77 180 top
C102  100nF  [C0603_DWS]  77.72,58.29 180 top
C103  22uF/6.3V  [C0603_DWS]  120.52,126.24 0 top
C104  22uF/6.3V  [C0603_DWS]  120.52,127.76 0 top
C105  22uF/6.3V  [C0603_DWS]  61.42,87.93 180 top
C106  220nF  [C0603_DWS]  61.42,86.41 180 top
C107  NC  [C0603_DWS]  73.84,97.46 180 top
C108  NC  [C0603_DWS]  73.84,95.94 180 top
C109  22uF/6.3V  [C0603_DWS]  53.26,73.99 90 top
C110  1uF  [C0603_DWS]  55.93,94.95 180 top
C111  220nF  [C0603_DWS]  55.93,88.85 0 top
C112  10uF/6.3V  [C0603_DWS]  55.93,87.33 0 top
C113  10uF/6.3V  [C0603_DWS]  55.93,91.9 0 top
C114  220nF  [C0603_DWS]  55.93,90.37 0 top
C117  220nF  [C0603_DWS]  50.83,64.62 90 top
C118  220nF  [C0603_DWS]  49.3,64.62 90 top
C119  220nF  [C0603_DWS]  61.42,84.89 180 top
C120  220nF  [C0603_DWS]  64.69,83.36 0 top
C121  10uF/6.3V  [C0603_DWS]  64.69,84.89 0 top
C122  100nF  [C0603_DWS]  21.03,41.61 90 top
C123  100uF/16V/LOWESR/105C/6.3x11mm_RM2.5  [E2,5-6,3]  15.47,43.66 270 top
C124  100nF  [C0603_DWS]  11.58,43.66 90 top
C125  100nF  [C0603_DWS]  29.26,44.2 180 top
C127  1nF  [C0603_DWS]  51.97,90.37 0 top
C129  1nF  [C0603_DWS]  51.97,93.42 0 top
C131  1nF  [C0603_DWS]  51.97,88.85 0 top
C132  1nF  [C0603_DWS]  51.97,91.9 0 top
C133  22uF/6.3V  [C0603_DWS]  49.3,67.89 90 top
C134  220nF  [C0603_DWS]  52.35,67.89 90 top
C138  22uF/6.3V  [C0603_DWS]  54.79,73.99 90 top
C139  220nF  [C0603_DWS]  56.31,73.99 90 top
C144  100nF  [C0603_DWS]  119.05,43.97 270 top
C145  10uF/6.3V  [C0603_DWS]  27.86,107.92 270 top
C146  3.3nF  [C0603_DWS]  122.1,43.97 270 top
C147  10uF/6.3V  [C0603_DWS]  120.57,47.27 270 top
C148  10uF/6.3V  [C0603_DWS]  119.79,49.66 180 top
C149  10uF/6.3V  [C0603_DWS]  28.75,110.34 0 top
C150  1uF  [C0603_DWS]  18.69,100.94 180 top
C151  10uF/6.3V  [C0603_DWS]  20.47,96.24 270 top
C152  10uF/6.3V  [C0603_DWS]  18.49,96.24 270 top
C153  NA  [C0603_DWS]  73.84,91.36 0 top
C154  NA  [C0603_DWS]  73.84,94.41 0 top
C155  220nF  [C0603_DWS]  73.84,86.79 0 top
C156  10uF/6.3V  [C0603_DWS]  23.65,96.98 180 top
C157  22uF/6.3V  [C0603_DWS]  73.84,88.32 180 top
C158  10uF/6.3V  [C0603_DWS]  32.05,109.83 180 top
C159  10uF/6.3V  [C0603_DWS]  36.73,93.34 270 top
C160  1nF  [C0603_DWS]  38.25,93.34 270 top
C161  100nF  [C0603_DWS]  121.16,37.36 180 top
C162  10uF/6.3V  [C0603_DWS]  30.63,93.34 270 top
C164  10uF/6.3V  [C0603_DWS]  40.79,104.17 180 top
C165  1nF  [C0603_DWS]  40.79,105.69 180 top
C166  10uF/6.3V  [C0603_DWS]  41.05,98.04 0 top
C167  1uF  [C0603_DWS]  34.47,107.42 270 top
C168  22uF/6.3V  [C0603_DWS]  48.69,77.27 90 top
C169  220nF  [C0603_DWS]  51.74,77.27 90 top
C170  100nF  [C0603_DWS]  115.6,37.03 270 top
C171  100nF  [C0603_DWS]  118.64,37.03 270 top
C172  10uF/6.3V  [C0603_DWS]  32.94,107.42 90 top
C173  22uF/6.3V  [C0603_DWS]  48.69,73.99 90 top
C174  1uF  [C0603_DWS]  37.11,105.69 180 top
C175  220nF  [C0603_DWS]  51.74,73.99 90 top
C176  100nF  [C0603_DWS]  117.12,37.03 270 top
C177  10uF/6.3V  [C0603_DWS]  37.11,102.64 180 top
C178  10uF/6.3V  [C0603_DWS]  41.05,93.98 0 top
C179  10uF/6.3V  [C0603_DWS]  22.5,102.97 180 top
C180  10uF/6.3V  [C0603_DWS]  22.5,104.5 180 top
C181  NA  [C0603_DWS]  64.69,90.98 0 top
C182  1nF  [C0603_DWS]  23.65,95.45 0 top
C183  NA  [C0603_DWS]  64.69,89.46 0 top
C184  220nF  [C0603_DWS]  61.42,90.98 0 top
C185  NA  [C0603_DWS]  64.69,87.93 0 top
C186  22uF/6.3V  [C0603_DWS]  61.42,92.51 180 top
C187  10uF/6.3V  [C0603_DWS]  41.05,92.46 0 top
C188  NA  [C0603_DWS]  64.69,86.41 0 top
C189  220nF  [C0603_DWS]  64.69,95.55 180 top
C190  22uF/6.3V  [C0603_DWS]  64.69,97.08 0 top
C191  220nF  [C0603_DWS]  61.42,95.55 0 top
C192  470nF  [C0603_DWS]  64.69,94.03 0 top
C193  22uF/6.3V  [C0603_DWS]  61.42,97.08 180 top
C194  22uF/6.3V  [C0603_DWS]  18.03,111.76 90 top
C195  22pF  [C0603_DWS]  10.67,114.17 0 top
C196  470nF  [C0603_DWS]  64.69,92.51 0 top
C198  22uF/6.3V  [C0603_DWS]  10.67,111.12 0 top
C199  22uF/6.3V  [C0603_DWS]  10.67,109.6 0 top
C200  10nF  [C0603_DWS]  22.99,134.37 90 top
C201  3.3nF  [C0603_DWS]  12.7,135.76 180 top
C202  470uF/25V/LOWESR/105C  [E5-10,5]  17.27,118.62 270 top
C203  100nF  [C0603_DWS]  12.7,132.72 180 top
C204  22uF/6.3V  [C0603_DWS]  23.88,138.43 180 top
C205  22uF/6.3V  [C0603_DWS]  23.88,136.91 180 top
C206  22uF/6.3V  [C0603_DWS]  26.16,119 0 top
C207  22uF/6.3V  [C0603_DWS]  37.97,116.87 270 top
C208  22pF  [C0603_DWS]  31.17,112.24 90 top
C209  22uF/6.3V  [C0603_DWS]  7.62,117.47 90 top
C210  22uF/6.3V  [C0603_DWS]  26.16,113.16 0 top
C211  22uF/6.3V  [C0603_DWS]  35.74,112.24 90 top
C212  22uF/6.3V  [C0603_DWS]  34.21,112.24 90 top
C219  22uF/6.3V  [C0603_DWS]  20.47,112.01 0 top
C220  22uF/6.3V  [C0603_DWS]  24.92,109.12 90 top
C221  100nF  [C0603_DWS]  23.39,109.12 90 top
CHGLED  LED/RED/0603  [LED-0603]  2.29,109.09 0 top
D1  1N5819(S4SOD-123)  [SOD-123]  76.05,44.96 0 top
D4  1N5822/SS34/SMA  [MLL-41]  27.05,134.11 180 top
D5  SMBJ16A  [DO214AA]  10.29,119.76 270 top
D6  1N5822/SS34/SMA  [MELF-MLL41]  26.67,122.12 0 top
FET1  IRLML6402  [SOT23]  27.56,137.41 0 top
GND  TESTPADTESTPAD_40-ROUND  [TESTPAD_40-ROUND]  11.43,97.16 0 bottom
GND_PIN  TESTPAD3  [TEST_PAD40/70/SQUARE]  4.45,12.7 0 top
IPSOUT  TESTPADTESTPAD_40-ROUND  [TESTPAD_40-ROUND]  24.13,97.16 0 bottom
JTAG  BH20S  [ML20-MALE]  105.41,13.97 180 top
L4  CL470nH/0805/1.76R/250mA  [L0805_5MIL_DWS]  120.52,124.46 0 top
L6  FB0805/600R/2A  [L0805_5MIL_DWS]  9.75,43.66 90 top
L7  FB0805/600R/200mA(201209-601)  [L0805_5MIL_DWS]  9.75,36.42 270 top
L12  2.2uH/1.5A/DCR<0.1R/CD32  [CD32]  23.27,100.03 180 top
L13  2.2uH/1.5A/DCR<0.1R/CD32  [CD32]  33.68,93.47 90 top
L14  2.2uH/1.5A/DCR<0.1R/CD32  [CD32]  40.67,101.09 180 top
L15  FB0805/600R/200mA(201209-601)  [L0805_5MIL_DWS]  116.48,30.53 270 top
L16  FB0805/600R/200mA(201209-601)  [L0805_5MIL_DWS]  120.73,34.19 0 top
L17  FB0805/600R/200mA(201209-601)  [L0805_5MIL_DWS]  118.52,30.53 270 top
L18  2.2uH/1.5A/DCR<0.1R/CD32  [CD32]  11.43,106.81 270 top
L19  10uH/3.15A/20%  [8X8MM_3131]  22.61,128.02 0 top
L20  2.2uH/1.5A/DCR<0.1R/CD32  [CD32]  29.87,116.23 180 top
L21  2.2uH/1.5A/DCR<0.1R/CD32  [CD32]  39.34,112.88 0 top
LCD_CON  BH40S  [ML40]  59.69,134.62 0 top
LED1  LED/GREEN/0603  [LED-0603]  2.29,112.65 0 top
LIPO_BAT  DW02R  [DW02R]  4.95,117.47 270 top
MIC1  AMF-097A44-NBAB  [MIC]  126.44,52.32 0 top
NAND_E  HN1x2(Close)  [JP1]  36.42,46.56 270 top
PWR  YDJ-1136  [PWR_JACK_UNI_MILLING]  7.75,122.28 0 top
PWR_BUT  T1107A(6x3.8x2.5mm)  [SW-TAKT_6X3.5_SMD]  5.21,136.65 90 top
PWR_LED  LED/RED/0603  [LED-0603]  2.29,105.54 0 top
Q2  32768Hz/6pF  [TC26H_3_REPAIR_SMD]  87.33,53.72 180 top
Q3  Q24.000MHz/HC-49SM/SMD/20ppm/20pF  [HC49/SMD2_THIN]  45.11,72.16 270 top
R1  2k/1%  [R0603_5MIL_DWS]  95.63,46.02 270 top
R2  2k/1%  [R0603_5MIL_DWS]  91.06,46.02 90 top
R3  1R  [R0603_5MIL_DWS]  80.39,98.98 0 top
R4  10k  [R0603_5MIL_DWS]  86.33,93.57 180 top
R5  NA  [R0603_5MIL_DWS]  97.31,46.02 270 top
R6  2k/1%  [R0603_5MIL_DWS]  98.83,46.02 270 top
R7  240R/1%  [R0603_5MIL_DWS]  99.59,107.21 270 top
R8  2k/1%  [R0603_5MIL_DWS]  103.4,46.02 90 top
R9  240R/1%  [R0603_5MIL_DWS]  101.88,92.74 270 top
R10  240R/1%  [R0603_5MIL_DWS]  104.62,73.69 180 top
R11  240R/1%  [R0603_5MIL_DWS]  101.88,60.73 270 top
R12  NA  [R0603_5MIL_DWS]  86.33,92.05 180 top
R15  NA  [R0603_5MIL_DWS]  86.33,95.1 180 top
R16  240R/1%  [R0603_5MIL_DWS]  73.84,85.27 180 top
R18  10k  [R0603_5MIL_DWS]  31.78,59.36 270 top
R19  10k  [R0603_5MIL_DWS]  30.25,56.72 90 top
R21  10k  [R0603_5MIL_DWS]  31.01,52.5 0 top
R23  NA  [R0603_5MIL_DWS]  77.11,102.03 0 top
R24  0R(Board_Mounted)  [0603_0R]  77.11,100.51 180 top
R27  47k  [R0603_5MIL_DWS]  74.45,46.86 180 top
R28  47k  [R0603_5MIL_DWS]  65.61,44.04 0 top
R29  NA(1M)  [R0603_5MIL_DWS]  120.52,134.87 180 top
R30  10k  [R0603_5MIL_DWS]  120.52,133.35 180 top
R31  1R  [R0603_5MIL_DWS]  61.42,89.46 0 top
R32  2.2k  [R0603_5MIL_DWS]  5.59,112.65 180 top
R33  10k  [R0603_5MIL_DWS]  120.52,136.4 180 top
R34  0R(Board_Mounted)  [0603_0R]  55.93,93.42 0 top
R36  200k/1%  [R0603_5MIL_DWS]  55.93,85.8 180 top
R42  4.99k/1%  [R0603_5MIL_DWS]  24.08,41.61 90 top
R43  0R(Board_Mounted)  [0603_0R]  73.84,98.98 180 top
R44  10k  [R0603_5MIL_DWS]  31.47,41.61 270 top
R45  13k/1%  [R0603_5MIL_DWS]  25.6,41.61 270 top
R46  10k  [R0603_5MIL_DWS]  22.56,41.61 270 top
R49  NA  [R0603_5MIL_DWS]  85.42,119.41 270 top
R50  NA  [R0603_5MIL_DWS]  86.94,119.41 270 top
R51  1R  [R0603_5MIL_DWS]  50.83,67.89 270 top
R52  47k  [R0603_5MIL_DWS]  11.58,36.42 90 top
R53  1R  [R0603_5MIL_DWS]  57.84,73.99 270 top
R56  4.7k  [R0603_5MIL_DWS]  120.57,43.97 90 top
R57  2k  [R0603_5MIL_DWS]  119.05,47.27 90 top
R58  240R/1%  [R0603_5MIL_DWS]  22.5,106.02 0 top
R59  0.03R/1%  [R1206_5MIL_WS]  18.69,99.03 180 top
R60  1R  [R0603_5MIL_DWS]  73.84,89.84 180 top
R61  2.2k  [R0603_5MIL_DWS]  122.1,47.27 90 top
R62  1R  [R0603_5MIL_DWS]  29.64,107.92 270 top
R63  1R  [R0603_5MIL_DWS]  31.17,107.42 270 top
R64  192R/1%  [R0603_5MIL_DWS]  55.93,84.28 0 top
R65  2.2k  [R0603_5MIL_DWS]  5.59,109.09 0 top
R66  1R  [R0603_5MIL_DWS]  50.22,77.27 270 top
R67  200k/1%  [R0603_5MIL_DWS]  37.11,104.17 180 top
R68  1R  [R0603_5MIL_DWS]  50.22,73.99 270 top
R69  0R(Board_Mounted)  [0603_0R]  41.05,95.5 180 top
R70  2.2k  [R0603_5MIL_DWS]  23.65,93.93 0 top
R71  1R  [R0603_5MIL_DWS]  61.42,94.03 180 top
R72  1R  [R0603_5MIL_DWS]  64.69,98.6 0 top
R73  2.2k  [R0603_5MIL_DWS]  29.11,93.34 90 top
R74  1R  [R0603_5MIL_DWS]  61.42,98.6 180 top
R75  2.2k  [R0603_5MIL_DWS]  27.58,93.34 270 top
R76  2.2k  [R0603_5MIL_DWS]  26.06,93.34 270 top
R77  4.99k/1%  [R0603_5MIL_DWS]  10.67,112.65 0 top
R78  3.3k/1%  [R0603_5MIL_DWS]  15.62,112.65 0 top
R79  47k  [R0603_5MIL_DWS]  12.7,134.24 0 top
R80  4.99k/1%  [R0603_5MIL_DWS]  16.74,138.43 180 top
R81  2.2k  [R0603_5MIL_DWS]  5.59,105.54 180 top
R85  2.2k  [R0603_5MIL_DWS]  12.7,137.29 0 top
R86  1k/1%  [R0603_5MIL_DWS]  20.02,138.43 0 top
R87  0R(Board_Mounted)  [0603_0R]  10.67,115.7 0 top
R88  8.2k/1%  [R0603_5MIL_DWS]  23.75,118.11 90 top
R89  4.99k/1%  [R0603_5MIL_DWS]  32.69,112.24 90 top
R90  1.1k/1%  [R0603_5MIL_DWS]  23.75,114.05 270 top
R92  1.1k/1%  [R0603_5MIL_DWS]  32.69,116.08 90 top
R106  22R  [R0603_5MIL_DWS]  86.33,86.56 180 top
R107  22R  [R0603_5MIL_DWS]  86.33,88.09 180 top
R108  22R  [R0603_5MIL_DWS]  86.33,81.08 180 top
R109  22R  [R0603_5MIL_DWS]  86.33,82.6 180 top
R110  22R  [R0603_5MIL_DWS]  86.33,89.61 180 top
R111  22R  [R0603_5MIL_DWS]  86.33,78.64 180 top
R112  22R  [R0603_5MIL_DWS]  86.64,73.69 180 top
R113  22R  [R0603_5MIL_DWS]  86.87,60.35 180 top
R114  22R  [R0603_5MIL_DWS]  86.64,70.64 180 top
R115  22R  [R0603_5MIL_DWS]  86.64,72.16 180 top
R116  22R  [R0603_5MIL_DWS]  86.87,63.4 180 top
R117  22R  [R0603_5MIL_DWS]  86.87,64.92 180 top
R118  22R  [R0603_5MIL_DWS]  83.06,76.68 180 top
R119  22R  [R0603_5MIL_DWS]  83.06,78.21 180 top
R120  22R  [R0603_5MIL_DWS]  86.33,76.28 180 top
R121  22R  [R0603_5MIL_DWS]  86.87,58.83 180 top
RECOVERY  T1107A(6x3.8x2.5mm)  [SW-TAKT_6X3.5_SMD]  88.9,106.68 180 top
RESET  T1107A(6x3.8x2.5mm)  [SW-TAKT_6X3.5_SMD]  50.8,106.68 180 top
RM1  RA0805_(4X0402)_22R  [R_MATRIX_4_0402_25X625]  82.68,86.03 180 top
RM2  RA0805_(4X0402)_22R  [R_MATRIX_4_0402_25X625]  82.68,88.77 180 top
RM3  RA0805_(4X0402)_22R  [R_MATRIX_4_0402_25X625]  82.68,83.36 180 top
RM4  RA0805_(4X0402)_22R  [R_MATRIX_4_0402_25X625]  82.68,80.31 180 top
RM5  RA0805_(4X0402)_22R  [R_MATRIX_4_0402_25X625]  82.68,71.7 180 top
RM6  RA0805_(4X0402)_22R  [R_MATRIX_4_0402_25X625]  82.68,74.6 180 top
RM7  RA0805_(4X0402)_22R  [R_MATRIX_4_0402_25X625]  82.68,69.04 180 top
RM8  RA0805_(4X0402)_22R  [R_MATRIX_4_0402_25X625]  82.68,66.37 180 top
RM14  RA1206_(4X0603)_4B8_100K  [R_MATRIX_4]  120.52,130.56 0 top
RM16  RA0805_(4X0402)_22R  [R_MATRIX_4_0402_25X625]  70.26,107.44 90 top
RM17  RA0805_(4X0402)_22R  [R_MATRIX_4_0402_25X625]  72.92,107.44 90 top
RM18  RA0805_(4X0402)_22R  [R_MATRIX_4_0402_25X625]  64.92,107.44 270 top
RM19  RA0805_(4X0402)_22R  [R_MATRIX_4_0402_25X625]  67.59,107.44 90 top
RM20  RA0805_(4X0402)_22R  [R_MATRIX_4_0402_25X625]  59.59,107.44 90 top
RM21  RA0805_(4X0402)_22R  [R_MATRIX_4_0402_25X625]  62.26,107.44 90 top
RM22  RA0805_(4X0402)_22R  [R_MATRIX_4_0402_25X625]  75.59,107.44 90 top
RM23  RA0805_(4X0402)_22R  [R_MATRIX_4_0402_25X625]  116.81,34.09 270 top
RM25  RA1206_(4X0603)_4B8_10k  [R_MATRIX_4]  107.44,20.19 90 top
RM26  RA1206_(4X0603)_4B8_10k  [R_MATRIX_4]  103.38,20.19 270 top
SCKE1  TESTPAD3  [TEST_PAD40/70/SQUARE]  86.46,56.77 180 top
SD/MMC1  MICRO_SD+CP  [TFR-MEM-CON]  123.7,130.68 270 top
U1  A10  [TFBGA441]  70.39,71.61 180 top
U2  H5TQ2G83CFR-H9C  [FBGA78]  99.19,100.23 90 top
U3  H5TQ2G83CFR-H9C  [FBGA78]  99.19,85.21 90 top
U4  H5TQ2G83CFR-H9C  [FBGA78]  99.19,68.21 90 top
U5  H5TQ2G83CFR-H9C  [FBGA78]  99.19,53.18 90 top
U8  H27UBG8T2BTR  [TSOP48]  43.61,54.91 270 top
U9  SY6280  [SOT23-5]  28.57,41.61 270 top
U12  AXP209(QFN48)  [QFN48]  30.63,101.22 0 top
U13  SY8008C(AA)C  [SOT23-5]  15.11,109.98 270 top
U14  MP1482DS  [SOIC8]  18.29,135 90 top
U15  SY8008C(AA)C  [SOT23-5]  35.36,116.08 0 top
U16  SY7208(SOT23-6)  [SOT23-6]  26.29,116.08 180 top
U19  FIDUCIAL1X2  [FIDUCIAL-1X2]  2.54,2.54 180 top
U20  FIDUCIAL1X2  [FIDUCIAL-1X2]  137.16,2.54 180 top
U21  FIDUCIAL1X2  [FIDUCIAL-1X2]  2.54,133.35 180 top
U$1  NANO_ITX_  [NANO-ITX_140X140]  0,0 0 top
U$5  [LOGO-OPENHARDWARE_8X8]  16.38,5.71 0 top
U$6  [OLIMEX1_V]  46.99,107.95 0 bottom
U$8  [OLIMEX1_V]  79.25,116.08 0 top
U$9  [PB]  24.51,5.71 0 top
U$10  [ESD_SYMBOL]  4.19,2.67 0 top
U$11  [RECYCLE_BIN1/8]  113.41,0.51 0 top
U$12  [ROHS]  121.79,1.27 0 top
UART0  NA(HN1X4)  [HN1X4]  117.12,57.68 90 top
USB_OTG  USB-OTG  [USB_MINI_9PIN]  4.45,40.39 0 top
VR1  AP1231-2.5V(SOT23-5)  [SOT-23-5]  20.98,109.12 180 top

## Tracks (layer width: path | path; a pad name or v marks a point on that pad's centre or on a via)
+5V  (via drill 0.4, 0.6)  (2 unrouted)
  Top 0.305: U9.5 30.15,42.55 C125.1
  Top 0.508: 29.46,132.16 5V_E.2
  Top 0.61: v31.01,44.2 C125.1 | v121.31,88.77 120.94,88.77 | 120.91,84.73 v121.31,84.73 123.77,84.73 124.54,85.5 v128.09,85.5 | 33.91,133.35 33.91,138.46 34.44,138.99 136.47,138.99 v136.63,138.84
  Top 0.762: 29.5,133.35 29.5,132.19 29.46,132.16
  Top 0.813: v17.75,81.84 16.79,81.84 | 16.18,87.68 17.75,86.11 v17.75,81.84 | v17.75,81.84 21.18,81.84 22.1,80.92 v22.1,78.79
  Top 1.016: FET1.2 29.31,135.51 29.31,134.3 D4.K 29.5,133.35 33.91,133.35 | 34.87,124.46 33.91,125.42 33.91,133.35 | 35.59,133.35 LCD_CON.1 33.91,133.35
  Bottom 0.508: 15.47,97.16 +5V.1
  Bottom 0.61: v121.31,84.73 v121.31,88.77 | v136.63,138.84 138.15,138.84 138.99,138 138.99,92.35 132.13,85.5 v128.09,85.5
  Bottom 0.813: 24.05,56.69 v24.28,56.69 | 24.05,56.69 v24.05,70.18 24.05,76.83 v22.1,78.79 | 24.05,44.2 24.05,56.69 | 24.05,44.2 v31.01,44.2 | 15.47,87.99 15.47,97.16 15.47,108.64 18.44,111.61 18.44,113.31 29.59,124.46 | 24.05,44.2 24.05,42.88 11.05,29.87 11.05,21.34 30.89,1.5 85.5,1.5
+5V_J-LINK
  Top 0.254: RM26.4.2 102.11,17.73 101.4,17.02 95.76,17.02 95.43,16.69
  Top 0.914: JTAG.19 95.43,16.69
+5V_OTG_PWR  (via drill 0.4, 0.6)
  Top 0.203: U12.31 30.43,104.88 30.68,105.13
  Top 0.508: R63.2 30.68,106.05 v30.68,105.77 v30.68,105.16 30.68,105.13
  Top 0.61: USB_OTG.VBUS 9.09,41.99 L6.1 9.88,42.77 C124.1 v12.57,42.77
  Bottom 0.61: 30.58,105.16 v30.68,105.16 v30.68,105.77
  Bottom 0.813: 30.58,105.16 27.13,101.7 27.13,99.97 26.59,99.44 26.59,96.77 26.14,96.32 26.14,91.9 14.63,80.39 14.63,66.6 16.69,64.54 16.69,48.39 13.64,45.34 13.64,43.84 v12.57,42.77
+15V  (via drill 0.4, 0.6)
  Top 0.203: U12.32 30.03,105.18 29.84,105.18 29.63,105.18 U12.33
  Top 0.508: 28.32,132.16 5V_E.1
  Top 0.61: R62.2 v29.64,105.97 29.84,105.77 29.84,105.18 | v6.48,106.38 R81.1
  Top 1.016: 24.77,136.47 C205.1 C204.1 v25.81,138.43 | 24.77,136.47 24.77,134.11 D4.A 24.61,133.23 25.68,132.16 25.71,132.16 | FET1.1 26.61,136.47 24.77,136.47 | 25.71,132.16 L19.2 25.71,125.53 29.03,125.53 31.24,123.32 v31.24,120.55 | 25.71,132.16 28.32,132.16 | v14.86,138.43 R80.2
  Route15 0.203: v6.48,106.38 18.21,106.38 v20.57,104.01
  Bottom 0.203: v29.64,105.97 29.64,105.69 28.35,104.39 26.06,104.39 25.68,104.01 v20.57,104.01 | v6.48,106.38 13.97,98.88 5VEXT.1
  Bottom 0.813: v31.24,120.55 31.24,118.49 29.64,116.89 v29.64,105.97
  Bottom 1.016: v14.86,138.43 16.13,137.16 24.54,137.16 v25.81,138.43
+24V  (via drill 0.4, 0.6)
  Top 0.203: U12.38 26.87,103.02 26.87,102.82 26.87,102.62 U12.39 | v25.55,101.7 25.96,101.7 26.24,101.42 U12.42
  Top 0.61: 26.87,102.82 v26.62,103.07 v26.62,103.68
  Top 0.813: C209.2 7.62,118.47 LIPO_BAT.1 4.4,118.47 3.58,117.65 3.58,115.88 4.47,114.99 6.66,114.99 8.53,113.11 8.53,104.85 12.45,100.94 v16.61,100.94
  Top 1.016: C152.1 17.63,97.99 17.63,99.03 | 17.63,99.03 R59.2 | v16.61,100.94 17.63,100.94 | 17.63,100.94 17.63,99.03 | 17.63,100.94 C150.2
  Bottom 0.203: 19.05,100.94 BAT.1
  Bottom 0.813: v26.62,103.68 v26.62,103.07 26.62,102.77 v25.55,101.7 24.79,100.94 19.05,100.94 v16.61,100.94
ADBG  (via drill 0.25)
  Top 0.152: U1.N8 v73.99,72.81 | v83.36,92.51 83.82,92.96 83.82,120.24 86.79,123.22 86.79,129.92 v86.56,130.15
  Route15 0.127: 77.74,72.41 78.24,72.41 | 76.94,72.41 77.44,72.41 | 76.14,72.41 76.64,72.41
  Route15 0.152: 78.24,72.41 78.27,72.41 79.7,73.85 79.7,88.47 83.36,92.13 v83.36,92.51 | 77.44,72.41 77.74,72.41 | 76.64,72.41 76.94,72.41 | 76.14,72.41 74.39,72.41 v73.99,72.81
  Bottom 0.152: 51.28,127.48 51.77,127.48 52.76,128.47 54.41,128.47 55.02,129.08 59.69,129.08 59.99,129.39 62.08,129.39 62.38,129.69 67.06,129.69 67.36,130 86.41,130 v86.56,130.15
BA0  (via drill 0.25)
  Top 0.127: 101.19,51.38 101.19,51.81 102.44,53.06 105.11,53.06 105.13,53.09 | 101.19,66.41 101.19,66.82 102.46,68.1 106.58,68.1 106.6,68.12 | 101.19,83.41 101.19,83.83 102.45,85.09 106.73,85.09 106.76,85.06 | 101.19,98.43 101.19,98.88 102.41,100.1 106.73,100.1 106.76,100.08
  Top 0.152: U5.J2 101.19,51.18 101.19,51.38 | U4.J2 101.19,66.2 101.19,66.41 | v106.91,55.85 106.83,55.85 106.45,55.47 106.45,54.41 105.13,53.09 | 106.6,68.12 108.74,70.26 108.74,71.78 v108.89,71.93 | U3.J2 101.19,83.2 101.19,83.41 | U2.J2 101.19,98.23 101.19,98.43 | v108.89,83.9 107.92,83.9 106.76,85.06 | 106.76,100.08 107.92,98.91 v108.89,98.91 | U1.K3 v77.99,69.61 | v95.1,72.92 95.25,73.08 101.65,73.08 103.63,75.06 109.04,75.06 v109.19,74.91
  Bottom 0.152: v106.91,55.85 106.98,55.85 108.58,57.45 108.58,64.39 108.74,64.54 108.74,71.78 v108.89,71.93 109.04,72.08 109.04,74.75 v109.19,74.91 109.35,75.06 109.35,75.82 109.04,76.12 109.04,79.55 108.74,79.86 108.74,83.74 v108.89,83.9 109.04,84.05 109.04,87.5 108.74,87.81 108.74,98.75 v108.89,98.91 | v77.99,69.61 78.29,69.61 78.56,69.88 84.63,69.88 87.53,72.77 94.94,72.77 v95.1,72.92
BA1  (via drill 0.25)
  Top 0.127: v101.29,55.88 U5.K8
  Top 0.152: U1.L4 v77.19,70.41 | v101.29,70.91 U4.K8 | v101.29,87.91 U3.K8 | v101.29,102.93 U2.K8 | v93.5,73.84 93.65,73.99 96.24,73.99 96.55,73.69 101.12,73.69 v101.42,73.99
  Bottom 0.152: 101.42,70.91 101.42,69.93 101.73,69.62 101.73,56.32 v101.29,55.88 | 101.42,87.91 101.73,88.21 101.73,101.62 101.42,101.93 101.42,102.8 v101.29,102.93 | 101.42,70.91 101.73,71.21 101.73,73.69 v101.42,73.99 101.42,77.5 101.73,77.8 101.73,86.49 101.42,86.79 101.42,87.91 | 101.42,70.91 v101.29,70.91 | 101.42,87.91 v101.29,87.91 | v77.19,70.41 77.65,70.87 78.26,70.87 78.33,70.79 84.25,70.79 87.15,73.69 93.34,73.69 v93.5,73.84
BA2  (via drill 0.25)
  Top 0.127: U5.J3 100.79,51.82 102.29,53.31 104.93,53.31 104.95,53.34 | U4.J3 100.79,66.83 102.31,68.35 106.4,68.35 106.43,68.38 | U3.J3 100.79,83.85 102.29,85.34 106.91,85.34 106.93,85.32 | U2.J3 100.79,98.89 102.26,100.36 106.91,100.36 106.93,100.33
  Top 0.152: v106.91,56.46 106.83,56.46 106.15,55.78 106.15,54.53 104.95,53.34 | v108.58,72.47 108.43,72.31 108.43,70.38 106.43,68.38 | v108.58,84.43 107.82,84.43 106.93,85.32 | v108.58,99.44 107.82,99.44 106.93,100.33 | U1.K4 v77.19,69.61 | v94.56,73.23 94.72,73.38 101.5,73.38 103.48,75.36 108.74,75.36 v108.89,75.51
  Bottom 0.127: 77.74,70 78.24,70
  Bottom 0.152: v106.91,56.46 106.98,56.46 108.28,57.76 108.28,64.52 108.43,64.67 108.43,72.31 v108.58,72.47 108.74,72.62 108.74,75.51 | v108.58,99.44 108.43,99.29 108.43,87.63 108.74,87.33 108.74,84.58 v108.58,84.43 108.43,84.28 108.43,79.7 108.74,79.4 108.74,75.51 | v77.19,69.61 77.59,70 77.74,70 | v108.89,75.51 108.74,75.51 | 78.24,70 78.26,70 78.44,70.18 84.51,70.18 87.4,73.08 94.41,73.08 v94.56,73.23
CASN  (via drill 0.25)
  Top 0.127: U5.G3 99.33,51.58 101.83,54.08 104.39,54.08 104.42,54.1 | U4.G3 99.35,66.61 101.85,69.11 105.87,69.11 105.89,69.14 | U3.G3 99.33,83.61 101.83,86.11 107.59,86.11 | U2.G3 99.29,98.63 101.78,101.12 107.59,101.12
  Top 0.152: v106.91,58.29 106.83,58.29 105.23,56.69 105.23,54.91 104.42,54.1 | v107.67,74.07 107.52,73.91 107.52,70.76 105.89,69.14 | v107.67,86.11 107.59,86.11 | v107.67,101.12 107.59,101.12 | U1.U3 v77.99,76 | v90.83,78.26 90.98,78.11 106.53,78.11 106.83,78.41 107.44,78.41 v107.67,78.18
  Bottom 0.152: v106.91,58.29 106.98,58.29 107.37,58.67 107.37,64.9 107.52,65.05 107.52,73.91 v107.67,74.07 107.82,74.22 107.82,74.83 107.52,75.13 107.52,78.18 | v107.67,101.12 107.52,100.97 107.52,87.17 107.82,86.87 107.82,86.26 v107.67,86.11 107.52,85.95 107.52,78.18 | v77.99,76 78.47,76 80.87,78.41 90.68,78.41 v90.83,78.26 | v107.67,78.18 107.52,78.18
CKE  (via drill 0.25)
  Top 0.152: U5.G9 99.21,56.4 v99.21,56.97 | U4.G9 99.21,71.43 v99.21,71.86 | U3.G9 99.21,88.43 v99.21,88.92 | v99.19,104.03 U2.G9 | R120.1 87.38,76.43 97.46,76.43 97.77,76.12 98.91,76.12 v99.21,76.43
  Bottom 0.152: 99.14,88.92 99.14,100.84 99.36,101.07 99.36,101.47 99.14,101.7 99.14,103.98 v99.19,104.03 | 99.14,88.92 99.14,86.92 99.36,86.69 99.36,86.21 99.06,85.9 99.06,76.43 | 99.06,71.86 99.06,76.43 | 99.06,71.86 99.06,70 99.36,69.7 99.36,65.84 99.14,65.61 99.14,65.15 99.36,64.92 99.36,57.12 v99.21,56.97 | 99.06,71.86 v99.21,71.86 | 99.14,88.92 v99.21,88.92 | 99.06,76.43 v99.21,76.43
CLK  (via drill 0.25)
  Top 0.127: R118.1 84.61,77.34 88.7,77.34 89.23,76.81 97.92,76.81 v98.07,76.66 | U5.F7 98.39,54.27 v98.3,54.18 | U4.F7 98.39,69.28 v98.3,69.19 | U3.F7 98.39,86.27 v98.3,86.18 | U2.F7 98.39,101.36 v98.3,101.27
  Bottom 0.127: 98.45,69.19 98.45,54.33 v98.3,54.18 | 98.45,69.19 v98.3,69.19 | 98.45,86.18 v98.3,86.18 | 98.45,86.18 98.45,77.47 98.15,77.17 98.15,76.66 | 98.15,76.66 v98.07,76.66 | 98.15,76.66 98.45,76.35 98.45,69.19 | v98.3,101.27 98.45,101.12 98.45,86.18
CLKM_SATA  (via drill 0.25)
  Top 0.152: v64.39,73.61 U1.P19 | v52.12,105.54 52.12,105.77 53.49,107.14 53.49,115.37 v53.03,115.82
  Route15 0.127: 62.54,73.2 63.04,73.2 | 63.34,73.2 63.84,73.2
  Route15 0.152: v64.39,73.61 63.99,73.2 63.84,73.2 | 63.04,73.2 63.34,73.2 | 62.54,73.2 61.93,73.2 59.97,71.25 51.97,71.25 45.64,64.92 45.03,64.92 v44.88,64.77
  Bottom 0.152: v44.88,64.77 44.88,64.87 44.42,65.33 44.42,85.85 48.08,89.51 48.08,95.61 49.3,96.83 49.3,102.46 52.12,105.28 v52.12,105.54 | v53.03,115.82 52.88,115.98 52.88,121.89 54.79,123.8 54.79,125.27 55.24,125.73 57.15,125.73 57.53,126.11
CLKN  (via drill 0.25)
  Top 0.127: R119.1 84.51,77.65 88.85,77.65 89.38,77.11 98.45,77.11 v98.6,76.96 | U4.G7 99.19,69.78 98.91,69.49 v98.91,69.44 | U5.G7 98.91,54.5 v98.91,54.42 | U3.G7 98.91,86.52 v98.91,86.45 | U2.G7 98.91,101.55 v98.91,101.27
  Bottom 0.127: v98.91,54.42 98.75,54.57 98.75,69.44 | 98.75,76.96 98.75,86.45 | 98.75,69.44 98.75,76.96 | v98.91,101.27 98.75,101.12 98.75,86.45 | 98.75,86.45 v98.91,86.45 | 98.75,69.44 v98.91,69.44 | 98.75,76.96 v98.6,76.96
CLKP_SATA  (via drill 0.25)
  Top 0.152: v64.39,74.41 U1.R19 | v52.73,115.29 53.19,114.83 53.19,107.29 51.51,105.61 v51.51,105.39
  Route15 0.127: 62.54,74 63.04,74 | 63.34,74 63.84,74
  Route15 0.152: v64.39,74.41 63.99,74 63.84,74 | 63.04,74 63.34,74 | 62.54,74 62.27,74 59.82,71.55 51.84,71.55 45.52,65.23 44.65,65.23 44.27,64.85 v44.27,64.77
  Bottom 0.152: v44.27,64.77 44.12,64.92 44.12,85.98 47.78,89.64 47.78,95.73 49,96.95 49,102.59 51.51,105.11 v51.51,105.39 | v52.73,115.29 52.58,115.44 52.58,122.02 54.48,123.93 54.48,125.6 55.37,126.49
CPU-REF  (via drill 0.25, 0.3, 0.4)
  Top 0.152: v76.39,78.41 U1.Y5 | v73.99,79.2 U1.AA8
  Top 0.203: v77.99,68 U1.H3 | v77.19,68 U1.H4
  Top 0.305: v89.23,47.7 89.23,47.22 C71.2
  Top 0.508: v97.31,44.27 R5.2 97.31,45.19 95.63,46.86 R1.1
  Top 0.61: R1.1 C1.2 C12.2 R2.2 C71.2
  Bottom 0.127: 75.99,77.36 75.99,77.86 | 73.59,77.36 73.59,77.86 | 73.99,79.02 73.59,78.62 73.59,78.16 | 76.64,68.41 76.14,68.41
  Bottom 0.152: v76.39,78.41 U1.Y5 75.99,77.86 | 73.59,77.86 73.59,78.16 | 73.59,77.36 73.59,77.28 73.77,77.11 75.89,77.11 | 73.99,79.02 v73.99,79.2 | 75.99,77.36 75.99,77.33 75.89,77.23 75.89,77.11 | 75.89,77.11 75.89,68.61 76.09,68.41 76.14,68.41 | 76.64,68.41 U1.H4 v77.19,68
  Bottom 0.203: v77.19,68 v77.99,68 78.56,67.43 78.56,66.82 81.13,64.26 81.13,56.31 89.23,48.21 v89.23,47.7
DDR3_ODT  (via drill 0.25, 0.25 pad 0.25)
  Top 0.152: v98.89,49.68 U5.G1 | 99.19,96.39 U2.G1 | 99.19,96.39 100.43,96.39 v100.89,95.94 | U4.G1 100.03,64.16 v100.66,64.16 | R15.1 87.38,94.94 v88.09,94.94 | 99.19,96.39 v97.99,96.39 | v100.58,81.38 100.43,81.53 99.66,81.53 U3.G1
  Bottom 0.152: v98.89,49.68 98.89,52.94 100.97,55.02 100.97,55.47 100.81,55.63 100.81,57.68 101.12,57.99 101.12,62.66 100.81,62.97 100.81,64.16 | 100.81,64.16 100.81,69.95 100.97,70.1 100.97,70.56 100.81,70.71 100.81,71.32 100.43,71.7 100.43,80.8 100.51,80.87 100.51,81.31 v100.58,81.38 100.66,81.46 100.66,86.79 100.97,87.1 100.97,87.48 100.74,87.71 100.74,95.78 v100.89,95.94 | 100.81,64.16 v100.66,64.16 | v88.09,94.94 96.55,94.94 v97.99,96.39
DDR3_RST  (via drill 0.25)
  Top 0.127: v105.08,50.52 104.6,50.52 104.34,50.78 U5.N2 | U4.N2 105.61,65.81 105.88,65.53 v106.3,65.53 | U3.N2 105.76,82.81 106.05,82.53 v106.45,82.53 | U2.N2 105.75,97.83 106.05,97.54 v106.45,97.54
  Top 0.152: v88.01,94.03 87.68,94.03 R4.1
  Top 1.016: R4.1 R12.1
  Bottom 0.152: v105.08,50.52 105.23,50.67 105.23,54.48 106.15,55.4 106.15,65.38 v106.3,65.53 106.6,65.84 106.6,75.29 106.3,75.59 106.3,76.5 106.6,76.81 106.6,77.27 106.3,77.57 106.3,79.7 106.6,80.01 106.6,80.77 106.3,81.08 106.3,82.37 v106.45,82.53 106.6,82.68 106.6,89.38 106.3,89.69 106.3,97.38 v106.45,97.54 106.6,97.69 106.6,102.18 104.24,104.55 93.19,104.55 87.63,98.98 87.63,94.41 v88.01,94.03
DDR3_SDQM0
  Top 0.152: U1.AC6 75.19,81.34 81.25,87.4 83.41,87.4 85.01,89 85.01,89.18 R110.2
DDR3_SDQM1
  Top 0.152: U1.W1 79.77,77.2 81.58,79.02 85.06,79.02 R111.2
DDR3_SDQM2
  Top 0.127: 78.99,74.41 79.39,74.41
  Top 0.152: U1.R2 78.79,74.41 78.99,74.41 | 79.39,74.41 80.76,74.41 82.17,73 82.98,73 83.06,73.08 83.06,73.38 83.13,73.46 83.29,73.46 83.36,73.38 83.36,73.08 83.44,73 83.59,73 83.67,73.08 83.67,73.38 83.74,73.46 83.9,73.46 83.97,73.38 83.97,72.73 84.05,72.66 84.2,72.66 84.28,72.73 84.28,73.91 84.35,73.99 84.51,73.99 84.58,73.91 84.58,73.15 84.66,73.08 84.81,73.08 84.89,73.15 84.89,74.05 84.96,74.13 85.31,74.13 R112.2
DDR3_SDQM3
  Top 0.152: U1.G1 79.26,67.61 81.64,65.23 83.44,65.23 83.52,65.15 83.52,65 83.44,64.92 82.63,64.92 82.55,64.85 82.55,64.69 82.63,64.62 83.44,64.62 83.52,64.54 83.52,62.79 85.95,60.35 R113.2
DDR3_SDQS0  (via drill 0.25)
  Top 0.127: 75.59,80.2 75.59,80.61 | v84.66,86.56 R106.2
  Top 0.152: U1.AB6 75.59,80 75.59,80.2 | v75.67,81 75.59,80.92 75.59,80.61
  Bottom 0.127: v84.66,86.56 84.58,86.49 81.69,86.49 81.53,86.33 81.53,86.03 81.69,85.88 82.98,85.88 83.29,85.57 83.29,84.96 82.98,84.66 79.86,84.66 76.28,81.08 75.74,81.08 v75.67,81
DDR3_SDQS0#  (via drill 0.25)
  Top 0.127: v76.05,81.53 76.2,81.38 76.2,80.87 76.05,80.72 76.05,80.46 U1.AC5 | v84.53,87.17 R107.2
  Bottom 0.127: v84.53,87.17 84.53,87.1 84.23,86.79 81.46,86.79 81.15,86.49 81.15,85.88 81.46,85.57 82.83,85.57 82.98,85.42 82.98,85.11 82.83,84.96 79.7,84.96 76.28,81.53 v76.05,81.53
DDR3_SDQS1  (via drill 0.25)
  Top 0.127: U1.AB1 79.36,79.61 81.08,81.32 v81.08,81.99 | v84.66,81.31 85.22,81.31 R108.2
  Bottom 0.127: v81.08,81.99 81.15,82.07 81.15,83.24 81.32,83.4 81.92,83.4 82.14,83.17 82.14,82.37 82.22,82.3 82.53,82.3 82.6,82.37 82.6,82.98 82.83,83.21 83.44,83.21 84.66,81.99 v84.66,81.31
DDR3_SDQS1#  (via drill 0.25)
  Top 0.127: U1.AA2 78.79,79.2 79.42,79.2 81.53,81.32 v81.53,81.53 | v83.97,81.99 84.15,82.17 85.01,82.17 R109.2
  Bottom 0.127: v81.53,81.53 81.53,82.94 81.61,83.02 81.76,83.02 81.84,82.94 81.84,82.23 82.08,81.99 82.68,81.99 82.91,82.22 82.91,82.75 82.98,82.83 83.13,82.83 v83.97,81.99
DDR3_SDQS2  (via drill 0.25)
  Top 0.127: U1.R1 79.59,74 80.14,73.46 80.9,73.46 v80.97,73.53 | R114.2 85.75,70.69 84.73,71.7 v84.73,71.93
  Bottom 0.127: v80.97,73.53 80.85,73.41 80.85,72.92 81.15,72.62 84.05,72.62 v84.73,71.93
DDR3_SDQS2#  (via drill 0.25)
  Top 0.127: U1.P2 78.79,73.61 79.56,73.61 80.09,73.08 v81.43,73.08 | R115.2 85.37,72.54 v84.81,72.54
  Bottom 0.127: v81.43,73.08 81.58,72.92 84.2,72.92 84.58,72.54 v84.81,72.54
DDR3_SDQS3  (via drill 0.25)
  Top 0.127: U1.K1 79.22,69.98 79.68,69.98 80.24,69.42 v80.47,69.42 | v85.19,63.86 85.52,63.86 R116.2
  Bottom 0.127: v80.47,69.42 80.24,69.19 80.24,67.89 81.23,66.9 83.41,66.9 84.28,66.04 84.28,64.47 84.89,63.86 v85.19,63.86
DDR3_SDQS3#  (via drill 0.25)
  Top 0.127: U1.J2 78.79,69.61 79.59,69.61 80.47,68.73 v80.7,68.73 | v85.19,64.47 85.5,64.47 85.98,64.95
  Top 0.152: 85.98,64.95 R117.2
  Bottom 0.127: v80.7,68.73 80.7,67.89 81.38,67.21 83.57,67.21 84.58,66.19 84.58,64.72 84.84,64.47 v85.19,64.47
DQ0
  Top 0.127: U2.B3 95.19,98.47 94.95,98.23 94.11,98.23
  Top 0.152: RM1.2.1 83.66,85.78 84.25,85.19 88.06,85.19 89.99,87.12 89.99,88.77 91.67,90.45 91.67,94.34 91.75,94.41 92.28,94.41 92.43,94.56 92.43,95.17 92.28,95.33 91.75,95.33 91.67,95.4 91.67,95.56 91.75,95.63 93.65,95.63 93.73,95.56 93.73,95.22 93.8,95.15 93.95,95.15 94.03,95.22 94.03,96.42 93.9,96.55 92.35,96.55 92.28,96.62 92.28,96.77 92.35,96.85 93.42,96.85 93.5,96.93 93.5,98.15 93.58,98.23 94.11,98.23
DQ1
  Top 0.127: 95.83,101.09 95.99,101.25 U2.C7
  Top 0.152: RM2.2.1 83.62,88.52 84.12,89.03 84.12,90.37 84.43,90.68 88.77,90.68 88.92,90.83 88.92,92.28 88.32,92.89 88.32,93.19 88.92,93.8 88.92,95.61 88.82,95.71 88.47,95.71 88.39,95.78 88.39,95.94 88.47,96.01 88.85,96.01 88.92,96.09 88.92,96.24 88.85,96.32 88.32,96.32 88.24,96.39 88.24,96.55 88.32,96.62 88.85,96.62 88.92,96.7 88.92,97.23 92.79,101.09 95.83,101.09
DQ2
  Top 0.127: U2.C2 95.99,98.03 95.59,98.43 95.59,98.82 95.35,99.06 95.33,99.06